# EAGLE board Opentrons_smoothieboard-5driver (EAGLE 7.2.0), part 1 of 3
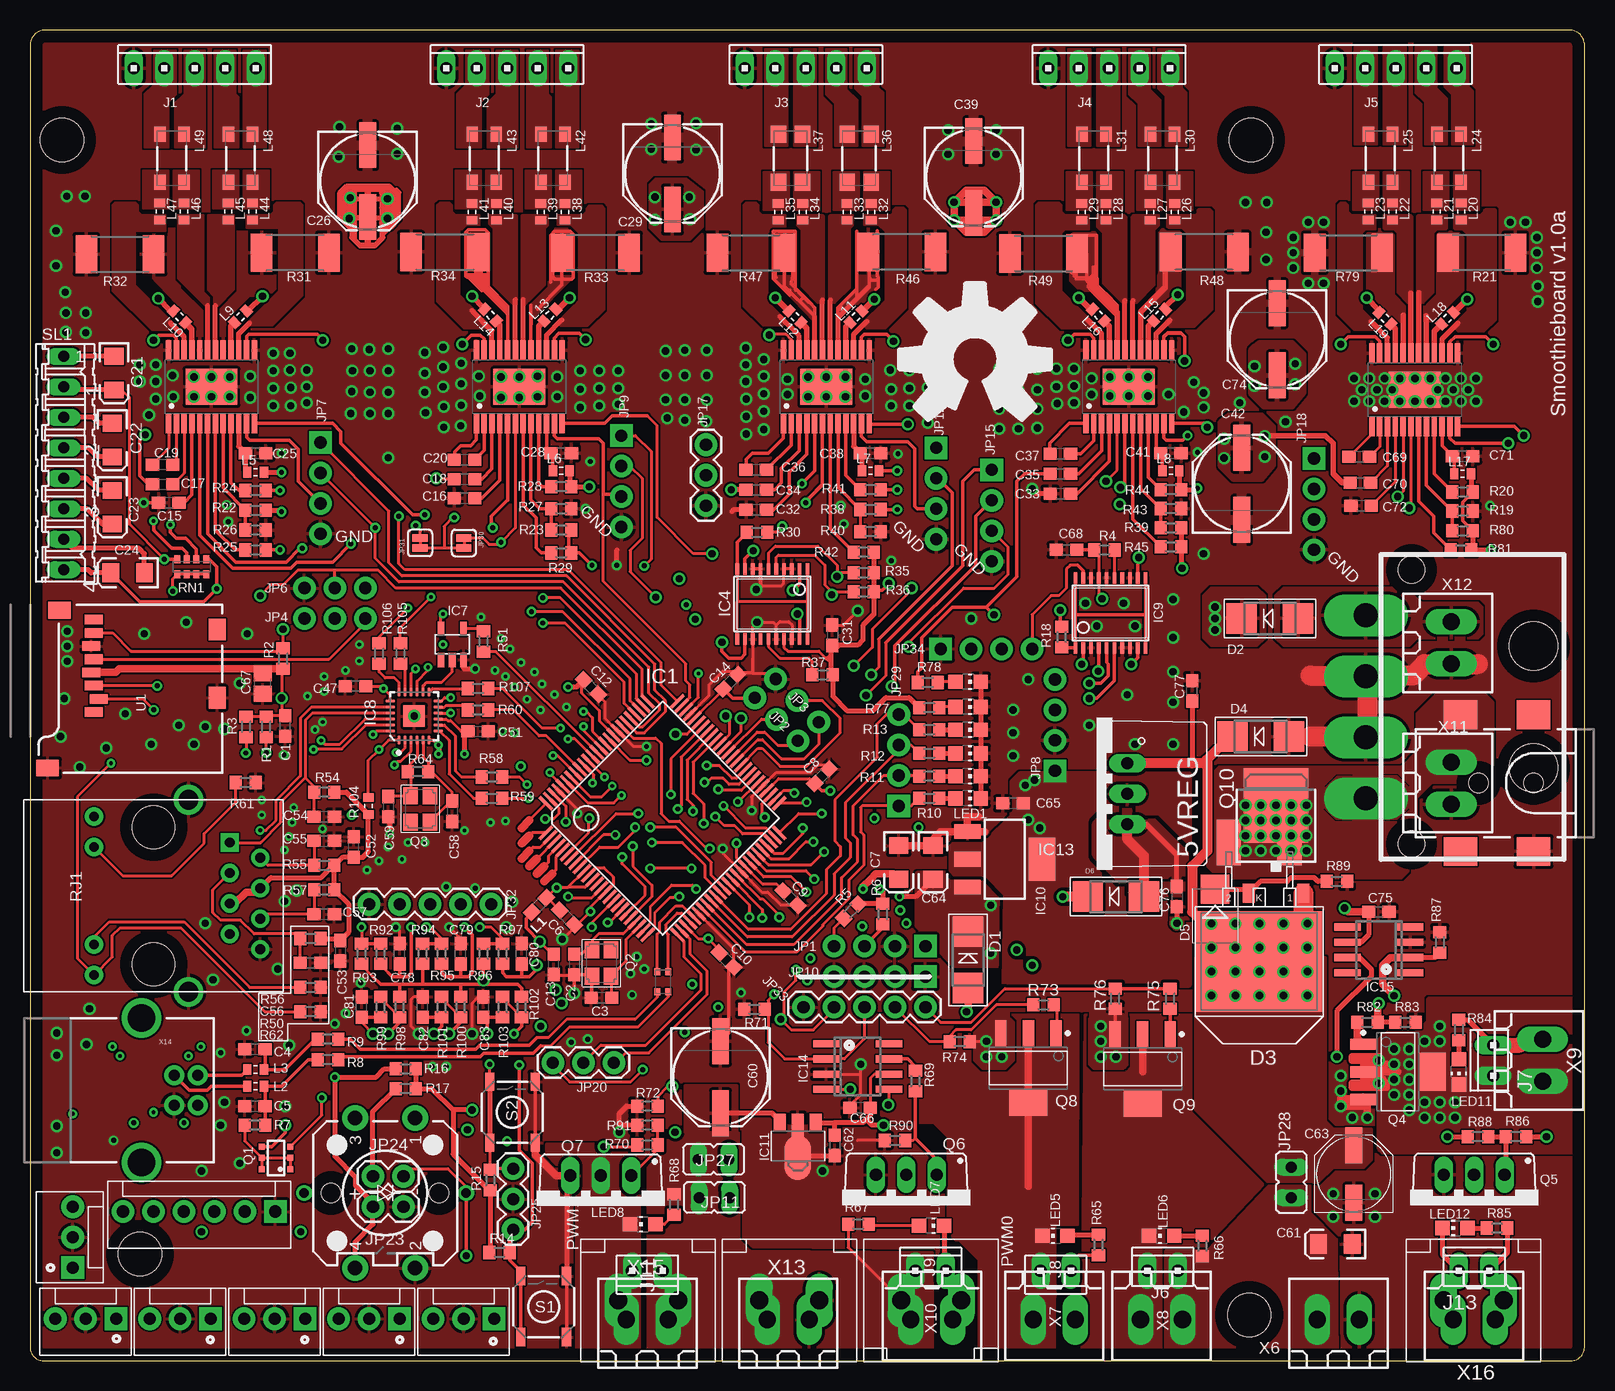
[diagram p4: board, top side]
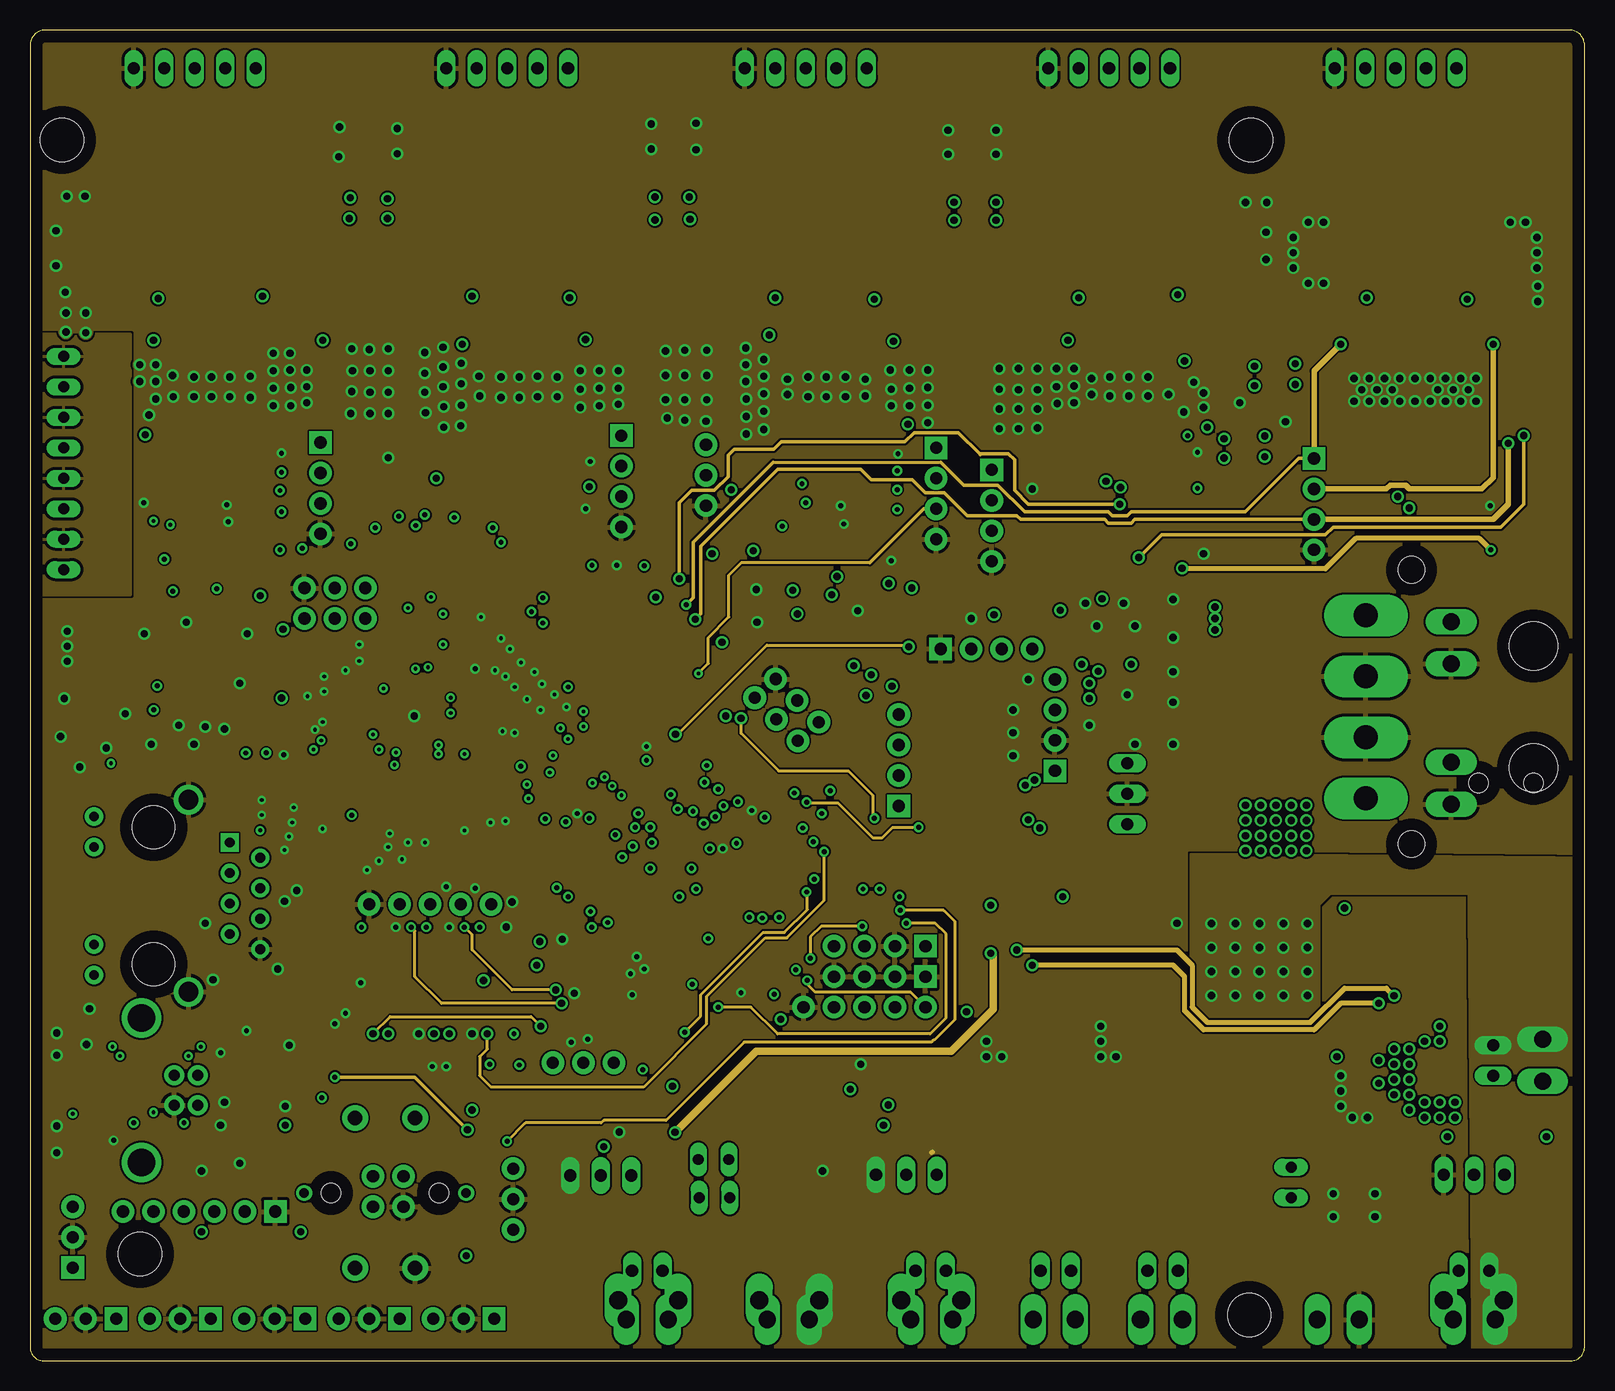
[diagram p5: board, inner layer GND]
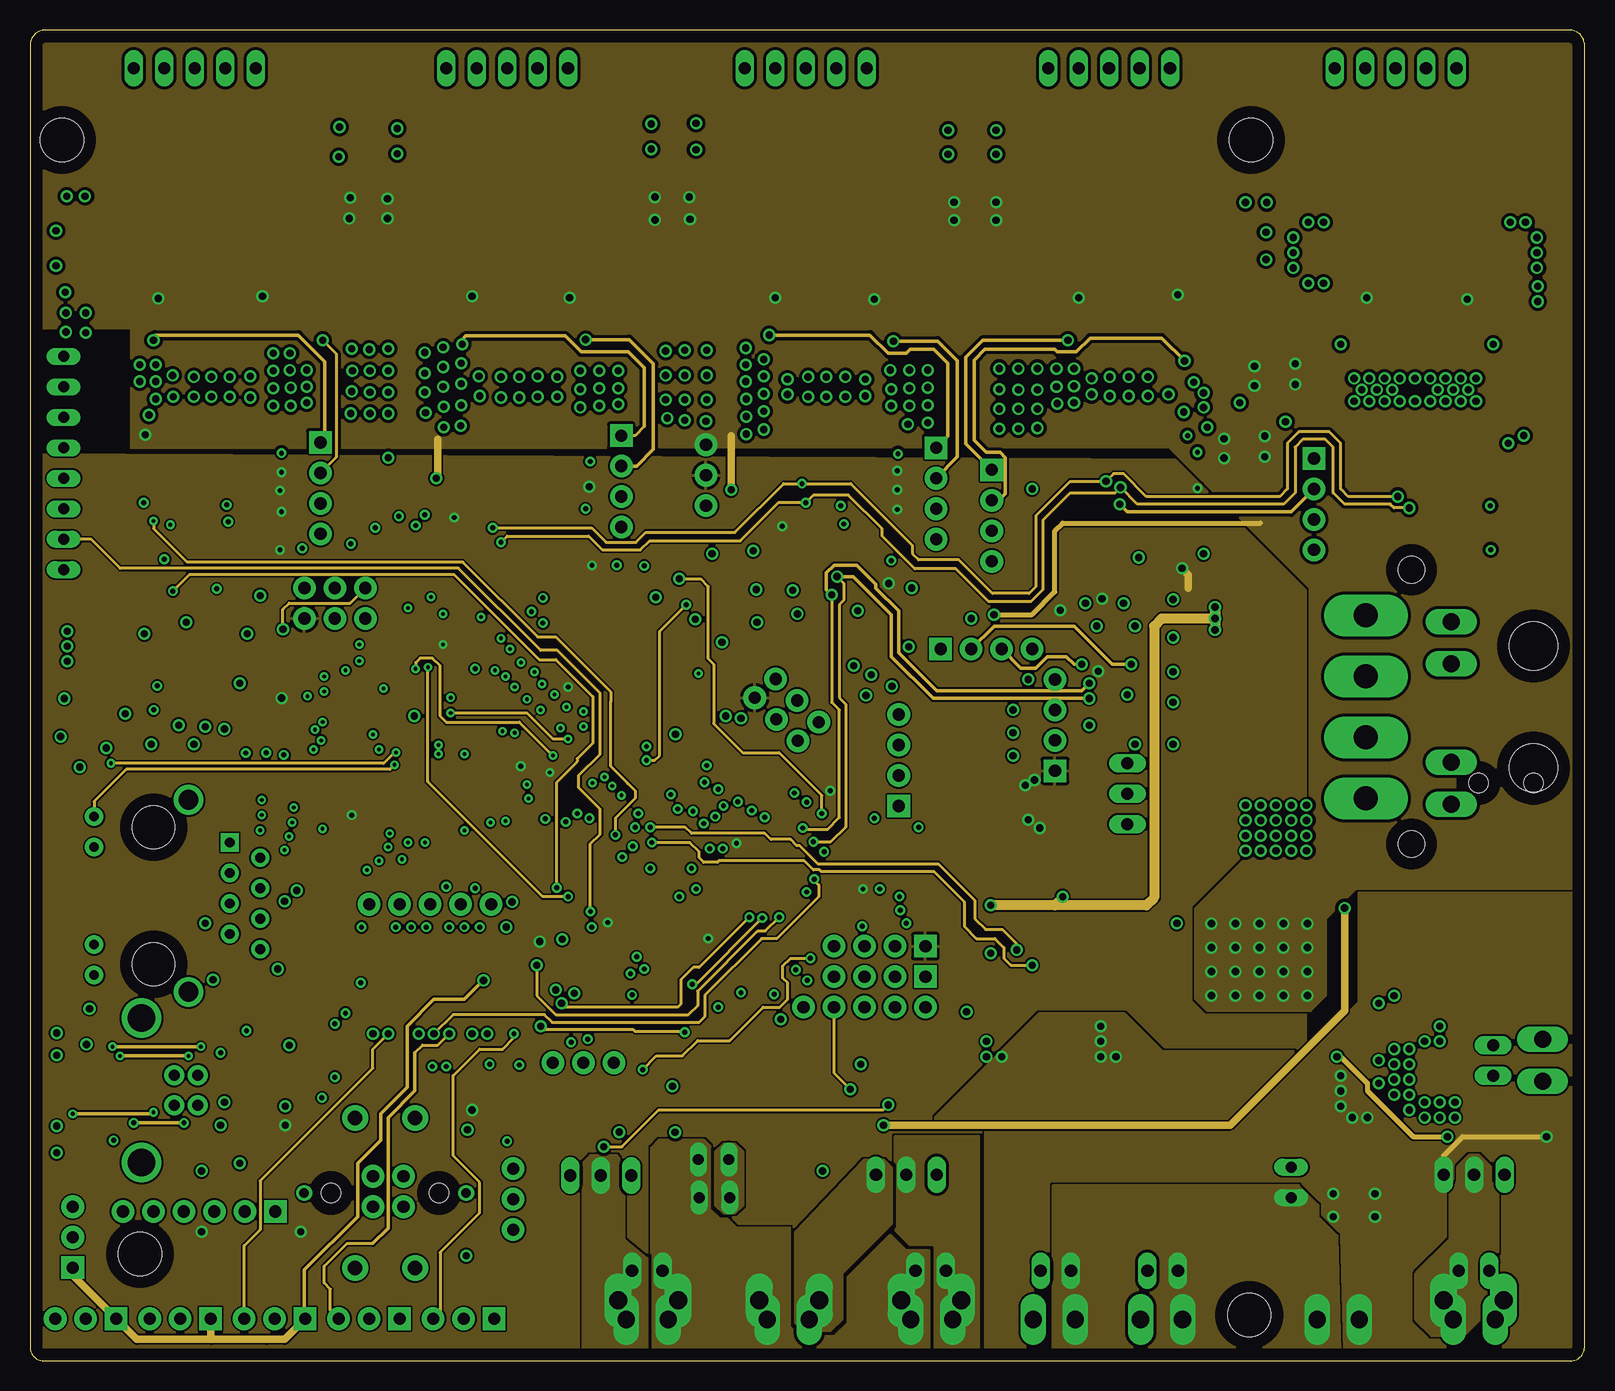
[diagram p6: board, inner layer Power]
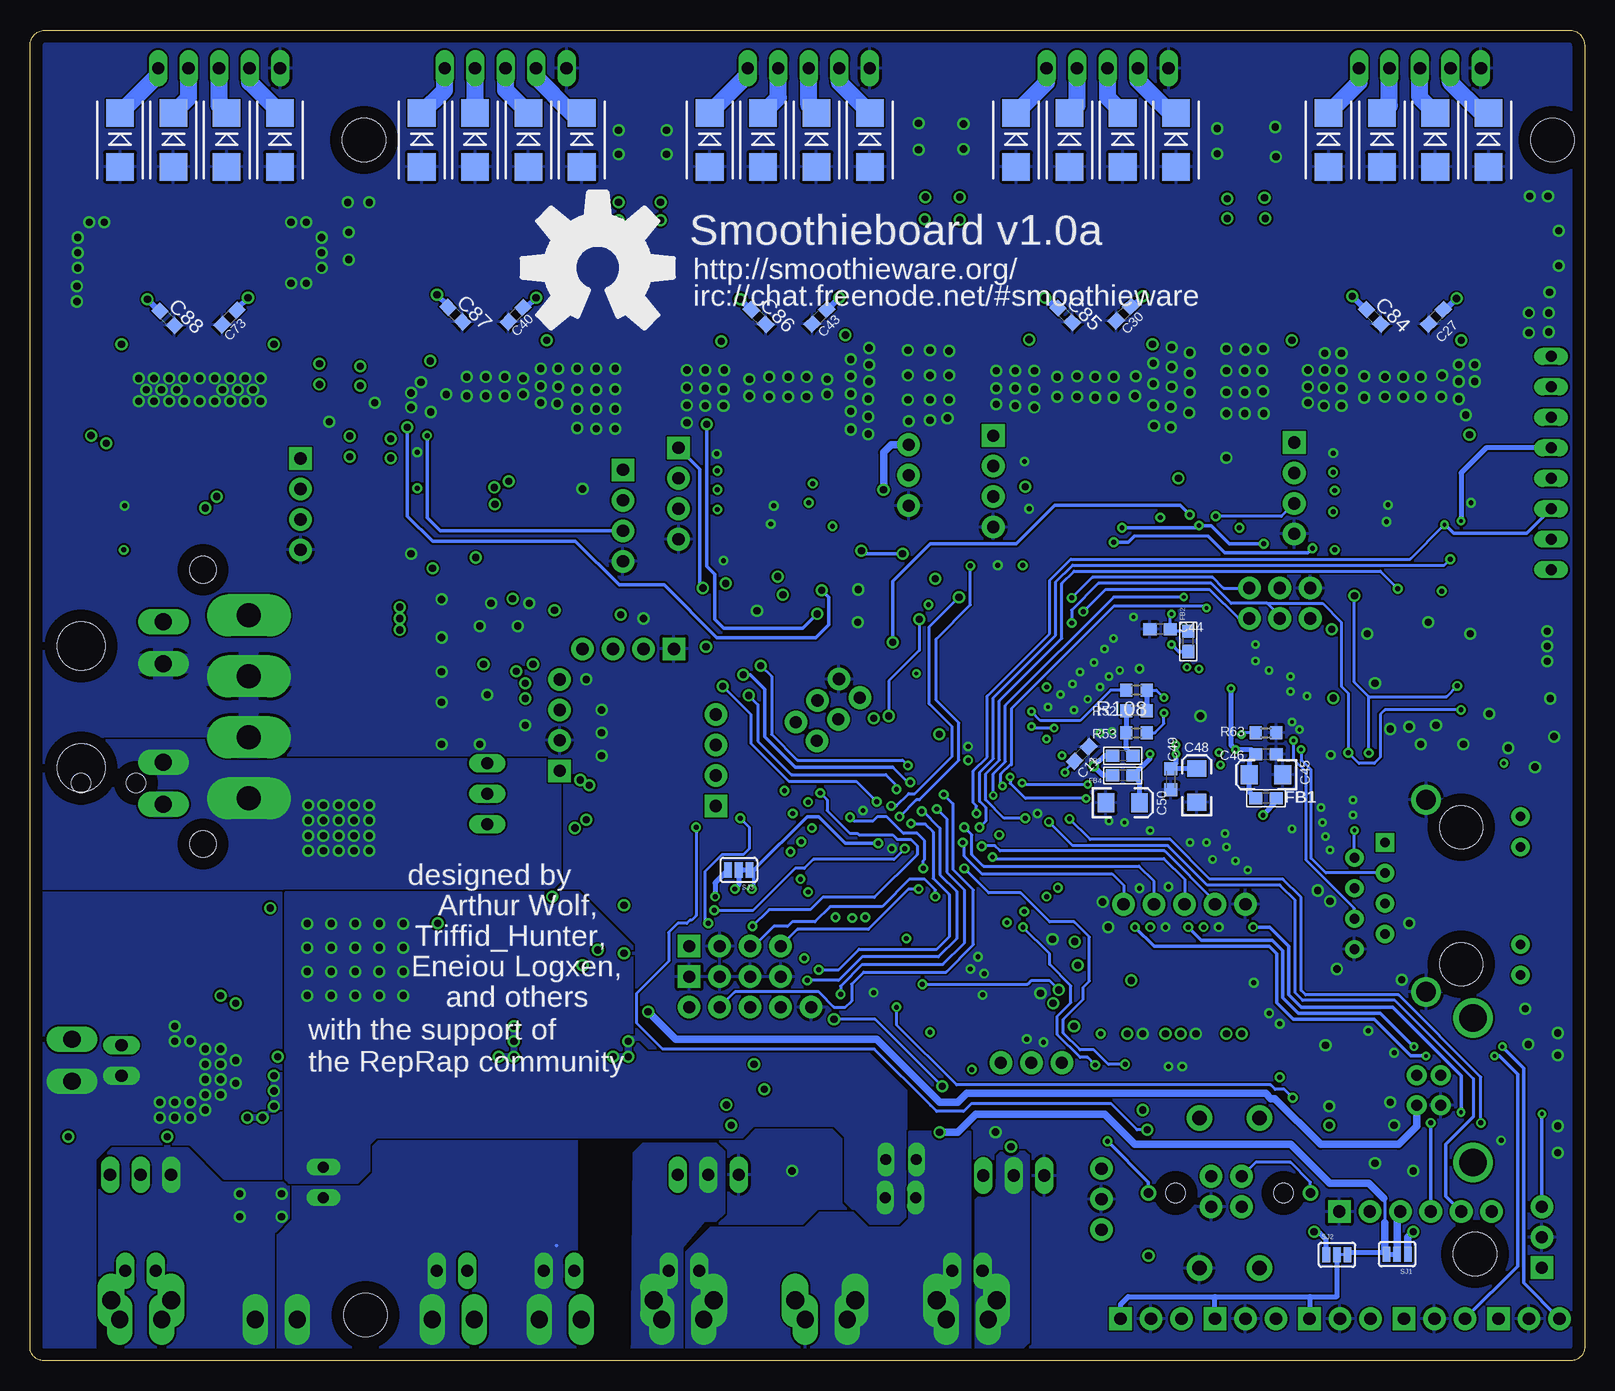
[diagram p7: board, bottom side, seen from below]

Size 129.55 x 110.89 mm. Coordinates in mm from the lower left corner, seen from the top.
Outline: 128.28,110.89 1.28,110.89 arc90 0.01,109.62 0.01,1.27 arc90 1.01,0 128.54,0 arc90 129.55,1.27 129.55,109.62 arc90 128.28,110.89
Copper layers (1*2+15*16): Top 0.035mm / dielectric 0.5mm / GND 0.035mm / dielectric 0.5mm / Power 0.035mm / dielectric 0.5mm / Bottom 0.035mm
Design rules "default *": minimum track width 10mil, minimum drill 0.3mm, track to track 6mil, track to pad 6mil, pad to pad 6mil, via to via 6mil, smd to smd 6mil, copper to edge 40mil, drill to drill 8mil, minimum pad ring 10mil, minimum via ring 8mil, stop-mask expansion 0mil, vias tented up to drill 0.61mm, thermal gap 10mil
Holes 3.6 mm at 101.73,101.73 2.67,101.73 9.15,8.89 101.61,3.81
tRestrict: 8 lines

## Footprints (pad centres in the part's own frame; a part is rotated, then mirrored left to right if it is on the bottom)
C0603 = smd 1.1 x 1: 1 -0.85,0; 2 0.85,0
EIA3216 = smd 1.4 x 1.6: A 1.4,0; C -1.4,0
PANASONIC_E = smd 3.8 x 1.4: + 3,0; - -3,0
C0603K = smd 1.05 x 1.08: 1 -0.875,0; 2 0.875,0
PANASONIC_D = smd 3 x 1.4: + 2.4,0; - -2.4,0
C0805 = smd 1.3 x 1.5: 1 -0.85,0; 2 0.85,0
SMADIODE = smd 2.54 x 2.54: A 2.349,0; C -2.349,0
TO263AB = smd 2.032 x 3.81: 1 3.81,2.54; 2 8.89,2.54 | smd 10.668 x 8.382: K 6.35,12.446
SMB = smd 2.4 x 2.4: A 2.2,0; C -2.2,0
DO214-AA_(SMB) = smd 2.3 x 2.3: 1 -2.25,0; 2 2.25,0
0603 = smd 1.1 x 1: 1 -0.85,0; 2 0.85,0
LQFP100 = smd 0.27 x 1.5: 1 -6,-7.75; 2 -5.5,-7.75; 3 -5,-7.75; 4 -4.5,-7.75; 5 -4,-7.75; 6 -3.5,-7.75; 7 -3,-7.75; 8 -2.5,-7.75; 9 -2,-7.75; 10 -1.5,-7.75; 11 -1,-7.75; 12 -0.5,-7.75; 13 0,-7.75; 14 0.5,-7.75; 15 1,-7.75; 16 1.5,-7.75; 17 2,-7.75; 18 2.5,-7.75; 19 3,-7.75; 20 3.5,-7.75; 21 4,-7.75; 22 4.5,-7.75; 23 5,-7.75; 24 5.5,-7.75; 25 6,-7.75; 51 6,7.75; 52 5.5,7.75; 53 5,7.75; 54 4.5,7.75; 55 4,7.75; 56 3.5,7.75; 57 3,7.75; 58 2.5,7.75; 59 2,7.75; 60 1.5,7.75; 61 1,7.75; 62 0.5,7.75; 63 0,7.75; 64 -0.5,7.75; 65 -1,7.75; 66 -1.5,7.75; 67 -2,7.75; 68 -2.5,7.75; 69 -3,7.75; 70 -3.5,7.75; 71 -4,7.75; 72 -4.5,7.75; 73 -5,7.75; 74 -5.5,7.75; 75 -6,7.75 | smd 1.5 x 0.27: 26 7.75,-6; 27 7.75,-5.5; 28 7.75,-5; 29 7.75,-4.5; 30 7.75,-4; 31 7.75,-3.5; 32 7.75,-3; 33 7.75,-2.5; 34 7.75,-2; 35 7.75,-1.5; 36 7.75,-1; 37 7.75,-0.5; 38 7.75,0; 39 7.75,0.5; 40 7.75,1; 41 7.75,1.5; 42 7.75,2; 43 7.75,2.5; 44 7.75,3; 45 7.75,3.5; 46 7.75,4; 47 7.75,4.5; 48 7.75,5; 49 7.75,5.5; 50 7.75,6; 76 -7.75,6; 77 -7.75,5.5; 78 -7.75,5; 79 -7.75,4.5; 80 -7.75,4; 81 -7.75,3.5; 82 -7.75,3; 83 -7.75,2.5; 84 -7.75,2; 85 -7.75,1.5; 86 -7.75,1; 87 -7.75,0.5; 88 -7.75,0; 89 -7.75,-0.5; 90 -7.75,-1; 91 -7.75,-1.5; 92 -7.75,-2; 93 -7.75,-2.5; 94 -7.75,-3; 95 -7.75,-3.5; 96 -7.75,-4; 97 -7.75,-4.5; 98 -7.75,-5; 99 -7.75,-5.5; 100 -7.75,-6
ETSSOP24 = smd 4.32 x 3: EPAD 0,0 | smd 0.45 x 1.65: P01 -3.575,-3.05; P02 -2.925,-3.05; P03 -2.275,-3.05; P04 -1.625,-3.05; P05 -0.975,-3.05; P06 -0.325,-3.05; P07 0.325,-3.05; P08 0.975,-3.05; P09 1.625,-3.05; P10 2.275,-3.05; P11 2.925,-3.05; P12 3.575,-3.05; P13 3.575,3.05; P14 2.925,3.05; P15 2.275,3.05; P16 1.625,3.05; P17 0.975,3.05; P18 0.325,3.05; P19 -0.325,3.05; P20 -0.975,3.05; P21 -1.625,3.05; P22 -2.275,3.05; P23 -2.925,3.05; P24 -3.575,3.05
TSSOP20 = smd 0.305 x 0.991: 1 -2.925,-2.918; 2 -2.275,-2.918; 3 -1.625,-2.918; 4 -0.975,-2.918; 5 -0.325,-2.918; 6 0.325,-2.918; 7 0.975,-2.918; 8 1.625,-2.918; 9 2.275,-2.918; 10 2.925,-2.918; 11 2.925,2.918; 12 2.275,2.918; 13 1.625,2.918; 14 0.975,2.918; 15 0.325,2.918; 16 -0.325,2.918; 17 -0.975,2.918; 18 -1.625,2.918; 19 -2.275,2.918; 20 -2.925,2.918
SOT23-5 = smd 0.55 x 1.2: 1 -0.95,-1.3; 2 0,-1.3; 3 0.95,-1.3; 4 0.95,1.3; 5 -0.95,1.3
QFN24_4MM = smd 0.8 x 0.28: 1 -2,1.25; 2 -2,0.75; 3 -2,0.25; 4 -2,-0.25; 5 -2,-0.75; 6 -2,-1.25; 13 2,-1.25; 14 2,-0.75; 15 2,-0.25; 16 2,0.25; 17 2,0.75; 18 2,1.25 | smd 0.28 x 0.8: 7 -1.25,-2; 8 -0.75,-2; 9 -0.25,-2; 10 0.25,-2; 11 0.75,-2; 12 1.25,-2; 19 1.25,2; 20 0.75,2; 21 0.25,2; 22 -0.25,2; 23 -0.75,2; 24 -1.25,2 | smd 1.778 x 1.778: THERM 0,0
SOT223 = smd 1.219 x 2.235: 1 -2.311,-3.099; 2 0,-3.099; 3 2.311,-3.099 | smd 3.6 x 2.2: 4 0,3.099
SOT89 = smd 1 x 1.5: 1 -1.499,-1.981; 3 1.499,-1.981 | smd 1 x 2: 2 0,-1.727 | smd 2.2 x 3.7: 2@1 0,0.94
R-78 = drill 1.016 long: 1 -2.54,2.54; 2 0,2.54; 3 2.54,2.54
SOIC8 = smd 0.6 x 2.2: 1 -1.905,-2.6; 2 -0.635,-2.6; 3 0.635,-2.6; 4 1.905,-2.6; 5 1.905,2.6; 6 0.635,2.6; 7 -0.635,2.6; 8 -1.905,2.6
10X05MTA = drill 1.016 long: 1 5.08,0; 2 2.54,0; 3 0,0; 4 -2.54,0; 5 -5.08,0
10X02MTA = drill 1.016 long: 1 1.27,0; 2 -1.27,0
POWER_JACK_SMD = smd 2.8 x 2.4: GND 0,-5.7; P$4 6.1,-5.7; VIN0 0,5.7; VIN1 6.1,5.7 | hole 1.6: 0,0; 4.572,0
1X04_NO_SILK = drill 1.016 pad 1.88 square: 1 0,0 | drill 1.016 pad 1.88: 2 2.54,0; 3 5.08,0; 4 7.62,0
1X03_NO_SILK = drill 1.016 pad 1.88: 1 0,0; 2 2.54,0; 3 5.08,0
MOLEX-1X6 = drill 1.016 pad 1.88 square: 1 0,0 | drill 1.016 pad 1.88: 2 2.54,0; 3 5.08,0; 4 7.62,0; 5 10.16,0; 6 12.7,0
JP1 = drill 0.914 long: 1 0,-1.27; 2 0,1.27
MOLEX-1X3 = drill 1.016 pad 1.88 square: 1 0,0 | drill 1.016 pad 1.88: 2 2.54,0; 3 5.08,0
1X03 = drill 1.016 pad 1.88: 1 0,0; 2 2.54,0; 3 5.08,0
1X02 = drill 1.016 pad 1.88: 1 0,0; 2 2.54,0
SJ_2S = smd 0.635 x 1.27: 1 -0.412,0; 2 0.412,0
1X05 = drill 1.016 pad 1.88: 1 0,0; 2 2.54,0; 3 5.08,0; 4 7.62,0; 5 10.16,0
0603(1608) = smd 0.7 x 0.9: 1 -0.7,0; 2 0.7,0
L-2012 = smd 0.6 x 0.5: 1 -0.83,-0.47; 2 0.83,-0.47; 3 0.83,0.47; 4 -0.83,0.47
L-4525 = smd 1.25 x 0.95: 1 -2,-1; 2 2,-1; 3 2,1; 4 -2,1
L-4528 = smd 1.4 x 1.27: 1 -2,-1; 2 2,-1; 3 2,1; 4 -2,1
CHIP-LED0805 = smd 1.2 x 1.2: A 0,-1.05; C 0,1.05
MOLEX8981 = drill 2 pad 3.5 long: P$1 -1.27,2.54; P$2 -1.27,7.62; P$3 -1.27,12.7; P$4 -1.27,17.78 | hole 2.2: 2.54,21.59; 2.54,-1.27 | hole 4: 12.7,5.08; 12.7,15.24
SC74_INFINEON = smd 0.5 x 0.5: 1 -0.95,-1.2; 2 0,-1.2; 3 0.95,-1.2; 4 0.95,1.2; 5 0,1.2; 6 -0.95,1.2
CRYSTAL_3.2X2.5 = smd 1.4 x 1.2: 1 -1.1,-0.8; 2 1.1,0.8; GND1 -1.1,0.8; GND2 1.1,-0.8
SOT230P700X160-4N = smd 2.15 x 0.95: 1 -2.9,2.3; 2 -2.9,0; 3 -2.9,-2.3 | smd 2.15 x 3.15: 4 2.9,0
TO220BV = drill 1.016 long: D 0,-2.54; G -2.54,-2.54; S 2.54,-2.54
TO252 = smd 1 x 1.6: 1 -2.28,-4.8; 2 2.28,-4.8 | smd 5.4 x 6.2: 3 0,2.5
R0603 = smd 1 x 1.1: 1 -0.85,0; 2 0.85,0
R2512 = smd 1.8 x 3.2: 1 -2.8,0; 2 2.8,0
HR911105A = drill 0.813 pad 1.524: G+ 4.953,-6.604; G- 4.953,-4.064; GND -8.89,4.445; NC -6.35,3.175; P4 -8.89,-0.635; P5 -6.35,0.635; RD+ -6.35,-1.905; RD- -8.89,1.905; TD- -8.89,-3.175; Y+ 4.953,6.604; Y- 4.953,4.064 | drill 1.651 pad 2.159: SHIELD0 -2.921,8.001; SHIELD1 -2.921,-8.001 | drill 0.813 pad 1.524 square: TD+ -6.35,-4.445 | hole 3.556: 0,-5.715; 0,5.715
0603-ARV = smd 0.5 x 0.65: 1 -1.2,-0.625; 2 -0.4,-0.625; 3 0.4,-0.625; 4 1.2,-0.625; 5 1.2,0.625; 6 0.4,0.625; 7 -0.4,0.625; 8 -1.2,0.625
TACTILE_SWITCH_SMD = smd 1.524 x 0.762: 1 -2.54,1.905; 2 2.54,1.905; 3 -2.54,-1.905; 4 2.54,-1.905
TACTILE-PTH-LED-12MM = drill 1.2 pad 2.159: 1 -6.25,2.5; 2 6.25,2.5; 3 -6.25,-2.5; 4 6.25,-2.5 | drill 0.8: A 0,6.75; C 0,-6.75 | hole 1.6: 0,4.5; 0,-4.5
SJ_3 = smd 0.635 x 1.27: 1 -0.889,0; 2 0,0; 3 0.889,0
08P = drill 0.914 long: 1 -8.89,0; 2 -6.35,0; 3 -3.81,0; 4 -1.27,0; 5 1.27,0; 6 3.81,0; 7 6.35,0; 8 8.89,0
MICRO-SD-SOCKET-PP = smd 0.8 x 1.5: 1 -8.94,10.7; 2 -7.84,10.3; 3 -6.74,10.7; 4 -5.64,10.9; 5 -4.54,10.7; 6 -3.44,10.9; 7 -2.34,10.7; 8 -1.24,10.7 | smd 1.8 x 1.4: CD1 -2.05,0.4; CD2 -7.75,0.4 | smd 1.4 x 1.9: GND1 -13.6,14.55; GND3 -0.45,13.55
1715250000 = drill 1.5 long: P$1 0,0; P$2 5,0
180G-2 = drill 1.422 long: 1 -1.75,0; 2 1.75,0
USB-B-PTH = drill 0.914 pad 1.676: D+ 0,1.25; D- 1.981,1.25; GND 0,-1.25; VBUS 1.981,-1.25 | drill 2.286: S1 -2.718,-6.02; S2 -2.718,6.02

## Placement (x,y rotation side)
C1  .1uF  [C0603]  21.28,52.9 90 top
C2  12pF  [C0603]  45.35,33.02 270 top
C3  12pF  [C0603]  47.63,30.23 180 top
C4  18pF  [C0603]  18.74,25.97 0 top
C5  18pF  [C0603]  18.74,21.21 0 top
C6  .1uF  [C0603]  44.75,36.94 315 top
C7  10uF  [EIA3216]  72.4,41.53 270 top
C8  .1uF  [C0603]  65.98,48.7 225 top
C9  .1uF  [C0603]  63.38,38.54 135 top
C10  .1uF  [C0603]  58.05,33.4 135 top
C11  .1uF  [C0603]  41.92,50.55 225 bottom
C12  .1uF  [C0603]  46.74,56.13 135 top
C13  .1uF  [C0603]  43.64,33.03 90 top
C14  .1uF  [C0603]  58.36,56.58 225 top
C15  .22uF  [C0603]  11.56,71.5 0 top
C16  .22uF  [C0603]  36.2,71.88 0 top
C17  .1uF  [C0603]  11.06,73.02 0 top
C18  .1uF  [C0603]  36.2,73.47 0 top
C19  .1uF  [C0603]  11.06,74.68 180 top
C20  .1uF  [C0603]  36.2,75.06 180 top
C21  10uF  [EIA3216]  6.99,82.3 270 top
C22  10uF  [EIA3216]  6.87,76.71 270 top
C23  10uF  [EIA3216]  6.87,71.12 270 top
C24  10uF  [EIA3216]  8.14,65.66 180 top
C25  .1uF  [C0603]  18.8,75.63 0 top
C26  100uF  [PANASONIC_E]  28.14,98.3 270 top
C27  .1uF  [C0603]  12.39,86.99 225 bottom
C28  .1uF  [C0603]  44.27,75.63 0 top
C29  100uF  [PANASONIC_E]  53.54,98.93 270 top
C30  .1uF  [C0603]  38.43,87.25 225 bottom
C31  .1uF  [C0603]  66.87,60.45 270 top
C32  .22uF  [C0603]  60.52,70.93 0 top
C33  .22uF  [C0603]  85.86,72.26 0 top
C34  .1uF  [C0603]  60.52,72.58 0 top
C35  .1uF  [C0603]  85.86,73.91 0 top
C36  .1uF  [C0603]  60.52,74.23 180 top
C37  .1uF  [C0603]  85.86,75.56 180 top
C38  .1uF  [C0603]  70.05,75.63 0 top
C39  100uF  [PANASONIC_E]  78.65,98.63 270 top
C40  .1uF  [C0603]  89.08,87.17 225 bottom
C41  .1uF  [C0603]  95.07,75.63 0 top
C42  100uF  [PANASONIC_E]  100.98,73.08 90 top
C43  .1uF  [C0603]  63.76,86.99 225 bottom
C44  .1uF  [C0603]  35.38,60.96 180 bottom
C45  10uF  [EIA3216]  26.55,48.83 180 bottom
C46  .1uF  [C0603]  26.55,50.55 0 bottom
C47  .1uF  [C0603]  27.12,56.2 180 top
C48  1uF  [EIA3216]  32.33,47.94 90 bottom
C49  470pF  [C0603K]  34.49,48.45 270 bottom
C50  10uF  [EIA3216]  38.49,46.48 0 bottom
C51  .1uF  [C0603]  37.35,52.45 0 top
C52  .1uF  [C0603]  27,42.8 90 top
C53  .1uF  [C0603]  25.85,34.16 270 top
C54  18pF  [C0603]  24.52,45.34 0 top
C55  18pF  [C0603]  24.52,43.31 0 top
C56  18pF  [C0603]  23.38,33.15 0 top
C57  18pF  [C0603]  24.52,37.21 0 top
C58  12pF  [C0603]  35.19,45.78 270 top
C59  12pF  [C0603]  29.85,46.16 270 top
C60  100uF  [PANASONIC_E]  57.54,23.62 270 top
C61  10uF  [EIA3216]  108.78,9.72 180 top
C62  .1uF  [C0603]  67.06,17.94 270 top
C63  100uF  [PANASONIC_D]  110.31,15.56 90 top
C64  10uF  [EIA3216]  75.26,41.53 270 top
C65  .1uF  [C0603]  81.92,46.44 180 top
C66  .1uF  [C0603]  69.18,21.06 180 top
C67  1uF  [C0805]  19.41,56.43 90 top
C68  .1uF  [C0603]  86.37,67.56 0 top
C69  .1uF  [C0603]  110.77,75.31 180 top
C70  .1uF  [C0603]  110.86,73.15 0 top
C71  .1uF  [C0603]  119.39,75.37 0 top
C72  .22uF  [C0603]  110.93,71.25 0 top
C73  .1uF  [C0603]  112.93,86.94 225 bottom
C74  100uF  [PANASONIC_E]  103.93,85.12 270 top
C75  .1uF  [C0603]  112.4,37.4 0 top
C76  .1uF  [C0603]  95.58,38.67 270 top
C77  .33uF  [C0603]  96.85,55.82 90 top
C78  .1uF  [C0603]  30.81,33.91 90 top
C79  .1uF  [C0603]  35.89,33.91 90 top
C80  .1uF  [C0603]  40.97,33.91 90 top
C81  .1uF  [C0603]  27.63,29.46 90 top
C82  .1uF  [C0603]  32.71,29.46 90 top
C83  .1uF  [C0603]  37.79,29.46 90 top
C84  .1uF  [C0603]  17.58,86.99 315 bottom
C85  .1uF  [C0603]  43.29,87.12 315 bottom
C86  .1uF  [C0603]  68.84,86.97 315 bottom
C87  .1uF  [C0603]  94.11,87.17 315 bottom
C88  .1uF  [C0603]  118.12,86.87 315 bottom
D1  MBRA210LT3  [SMADIODE]  78.18,33.4 270 top
D2  MBRA210LT3  [SMADIODE]  103.32,61.85 0 top
D3  VS-25CTQ045S  [TO263AB]  108.78,45.72 180 top
D4  B1100-13-F  [SMADIODE]  102.56,52.01 0 top
D5  15v  [SMB]  98.75,37.08 270 top
D6  MBRA210LT3  [SMADIODE]  90.5,38.67 0 top
D7  SMBJ16(C)A  [DO214-AA_(SMB)]  21.34,101.73 90 bottom
D8  SMBJ16(C)A  [DO214-AA_(SMB)]  16.9,101.73 90 bottom
D9  SMBJ16(C)A  [DO214-AA_(SMB)]  12.45,101.73 90 bottom
D10  SMBJ16(C)A  [DO214-AA_(SMB)]  8.01,101.73 90 bottom
D11  SMBJ16(C)A  [DO214-AA_(SMB)]  47.38,101.73 90 bottom
D12  SMBJ16(C)A  [DO214-AA_(SMB)]  42.93,101.73 90 bottom
D13  SMBJ16(C)A  [DO214-AA_(SMB)]  38.49,101.73 90 bottom
D14  SMBJ16(C)A  [DO214-AA_(SMB)]  34.04,101.73 90 bottom
D15  SMBJ16(C)A  [DO214-AA_(SMB)]  72.91,101.73 90 bottom
D16  SMBJ16(C)A  [DO214-AA_(SMB)]  68.46,101.73 90 bottom
D17  SMBJ16(C)A  [DO214-AA_(SMB)]  64.02,101.73 90 bottom
D18  SMBJ16(C)A  [DO214-AA_(SMB)]  59.57,101.73 90 bottom
D19  SMBJ16(C)A  [DO214-AA_(SMB)]  96.91,101.73 90 bottom
D20  SMBJ16(C)A  [DO214-AA_(SMB)]  92.46,101.73 90 bottom
D21  SMBJ16(C)A  [DO214-AA_(SMB)]  88.02,101.73 90 bottom
D22  SMBJ16(C)A  [DO214-AA_(SMB)]  83.57,101.73 90 bottom
D23  SMBJ16(C)A  [DO214-AA_(SMB)]  122.05,101.73 90 bottom
D24  SMBJ16(C)A  [DO214-AA_(SMB)]  117.61,101.73 90 bottom
D25  SMBJ16(C)A  [DO214-AA_(SMB)]  113.16,101.73 90 bottom
D26  SMBJ16(C)A  [DO214-AA_(SMB)]  108.72,101.73 90 bottom
FB1  [0603]  26.55,46.86 180 bottom
FB2  BEAD0603S601A20T  [0603]  33.03,59.94 90 bottom
FB3  BEAD0603S601A20T  [0603]  38.49,50.42 180 bottom
FB4  BEAD0603S601A20T  [0603]  38.49,48.77 180 bottom
IC1  LPC1769  [LQFP100]  52.71,45.21 315 top
IC2  A4982  [ETSSOP24]  15.12,81.15 0 top
IC3  A4982  [ETSSOP24]  40.77,81.15 0 top
IC4  MCP44X1  [TSSOP20]  61.86,63.06 180 top
IC5  A4982  [ETSSOP24]  66.37,81.15 0 top
IC6  A4982  [ETSSOP24]  91.57,81.15 0 top
IC7  [SOT23-5]  35.19,59.69 0 top
IC8  [QFN24_4MM]  32.01,53.72 90 top
IC9  MCP44X1  [TSSOP20]  90.04,62.31 0 top
IC10  LM1117-3.3V  [SOT223]  81.22,41.78 270 top
IC11  78L12F  [SOT89]  63.99,17.86 180 top
IC12  A4982  [ETSSOP24]  115.4,80.91 0 top
IC13  R-78E-5.0  [R-78]  88.91,47.24 270 top
IC14  TC4427  [SOIC8]  68.97,24.51 270 top
IC15  TC4427  [SOIC8]  112.4,34.23 90 top
J1  [10X05MTA]  13.72,107.7 0 top
J2  [10X05MTA]  39.76,107.7 0 top
J3  [10X05MTA]  64.65,107.7 0 top
J4  [10X05MTA]  89.92,107.7 0 top
J5  [10X05MTA]  113.8,107.7 0 top
J6  [10X02MTA]  94.39,7.49 0 top
J7  [10X02MTA]  121.93,25.02 90 top
J8  [10X02MTA]  85.48,7.49 180 top
J9  [10X02MTA]  75.06,7.49 0 top
J10  POWER_JACKSMD  [POWER_JACK_SMD]  125.29,48.13 180 top
J11  [10X02MTA]  51.44,7.49 180 top
J13  [10X02MTA]  120.34,7.49 0 top
JP1  [1X04_NO_SILK]  74.62,34.54 180 top
JP2  [1X03_NO_SILK]  60.4,55.25 315 top
JP3  [1X03_NO_SILK]  65.73,53.21 135 top
JP4  [1X03_NO_SILK]  22.87,61.85 0 top
JP5  [MOLEX-1X6]  20.44,12.43 180 top
JP6  [1X03_NO_SILK]  27.95,64.39 180 top
JP7  [1X04_NO_SILK]  24.2,76.52 270 top
JP8  [1X04_NO_SILK]  85.42,49.15 90 top
JP9  [1X04_NO_SILK]  49.28,77.09 270 top
JP10  [1X04_NO_SILK]  74.62,32 180 top
JP11  [JP1]  57.03,13.59 270 top
JP12  [1X04_NO_SILK]  75.51,76.07 270 top
JP14  [MOLEX-1X3]  7.18,3.49 180 top
JP15  [1X04_NO_SILK]  80.14,74.23 270 top
JP16  [MOLEX-1X3]  15.06,3.49 180 top
JP17  [1X03]  56.33,76.33 270 top
JP18  [1X04_NO_SILK]  107.01,75.18 270 top
JP19  [MOLEX-1X3]  22.93,3.49 180 top
JP20  [1X03]  48.65,24.83 180 top
JP21  [MOLEX-1X3]  30.81,3.49 180 top
JP22  [MOLEX-1X3]  38.68,3.49 180 top
JP23  [1X02]  28.58,12.83 0 top
JP24  [1X02]  28.58,15.37 0 top
JP25  [1X03]  40.27,10.92 90 top
JP26  [MOLEX-1X3]  3.56,7.75 90 top
JP27  [JP1]  56.97,16.76 270 top
JP28  [JP1]  105.1,14.86 0 top
JP29  [1X04_NO_SILK]  72.4,46.23 90 top
JP30  [SJ_2S]  36.15,68.15 270 top
JP31  [SJ_2S]  32.51,68.14 90 top
JP32  [1X05]  38.43,38.04 180 top
JP33  [1X05]  74.62,29.46 180 top
JP34  [1X04_NO_SILK]  75.89,59.31 0 top
L1  [0603]  42.43,37.97 225 top
L2  BEAD0603S221T  [0603(1608)]  18.8,22.86 0 top
L3  BEAD0603S221T  [0603(1608)]  18.8,24.26 0 top
L4  CHOK2012S221T  [L-2012]  52.74,31.57 270 top
L5  BEAD0603S601A20T  [0603(1608)]  18.8,74.04 0 top
L6  BEAD0603S601A20T  [0603(1608)]  44.27,74.17 0 top
L7  BEAD0603S601A20T  [0603(1608)]  70.05,74.17 0 top
L8  BEAD0603S601A20T  [0603(1608)]  95.07,74.17 0 top
L9  BEAD0603S601A20T  [0603(1608)]  17.53,86.99 45 top
L10  BEAD0603S601A20T  [0603(1608)]  12.45,86.99 135 top
L11  BEAD0603S601A20T  [0603(1608)]  68.84,86.99 45 top
L12  BEAD0603S601A20T  [0603(1608)]  63.76,86.99 135 top
L13  BEAD0603S601A20T  [0603(1608)]  43.31,87.12 45 top
L14  BEAD0603S601A20T  [0603(1608)]  38.36,87.12 135 top
L15  BEAD0603S601A20T  [0603(1608)]  94.11,87.12 45 top
L16  BEAD0603S601A20T  [0603(1608)]  89.03,87.12 135 top
L17  BEAD0603S601A20T  [0603(1608)]  119.39,73.91 0 top
L18  BEAD0603S601A20T  [0603(1608)]  118.12,86.87 45 top
L19  BEAD0603S601A20T  [0603(1608)]  112.91,86.87 135 top
L20  BEAD0603S601A20T  [0603(1608)]  119.26,95.76 270 top
L21  BEAD0603S601A20T  [0603(1608)]  117.23,95.76 270 top
L22  BEAD0603S601A20T  [0603(1608)]  113.55,95.76 270 top
L23  BEAD0603S601A20T  [0603(1608)]  111.51,95.76 270 top
L24  CHOK4525S601A15T  [L-4525]  118.24,100.2 270 top
L25  CHOK4525S601A15T  [L-4525]  112.53,100.2 270 top
L26  BEAD0603S601A20T  [0603(1608)]  95.38,95.73 270 top
L27  BEAD0603S601A20T  [0603(1608)]  93.35,95.73 270 top
L28  BEAD0603S601A20T  [0603(1608)]  89.67,95.73 270 top
L29  BEAD0603S601A20T  [0603(1608)]  87.64,95.73 270 top
L30  CHOK4525S601A15T  [L-4525]  94.37,100.2 270 top
L31  CHOK4525S601A15T  [L-4525]  88.65,100.2 270 top
L32  BEAD0603S601A20T  [0603(1608)]  70.11,95.73 270 top
L33  BEAD0603S601A20T  [0603(1608)]  68.08,95.73 270 top
L34  BEAD0603S601A20T  [0603(1608)]  64.4,95.73 270 top
L35  BEAD0603S601A20T  [0603(1608)]  62.36,95.73 270 top
L36  CHOK4528S601A25T  [L-4528]  69.1,100.2 270 top
L37  CHOK4528S601A25T  [L-4528]  63.38,100.2 270 top
L38  BEAD0603S601A20T  [0603(1608)]  44.58,95.73 270 top
L39  BEAD0603S601A20T  [0603(1608)]  42.55,95.73 270 top
L40  BEAD0603S601A20T  [0603(1608)]  38.87,95.73 270 top
L41  BEAD0603S601A20T  [0603(1608)]  36.84,95.73 270 top
L42  CHOK4525S601A15T  [L-4525]  43.57,100.2 270 top
L43  CHOK4525S601A15T  [L-4525]  37.85,100.2 270 top
L44  BEAD0603S601A20T  [0603(1608)]  18.55,95.76 270 top
L45  BEAD0603S601A20T  [0603(1608)]  16.52,95.76 270 top
L46  BEAD0603S601A20T  [0603(1608)]  12.83,95.76 270 top
L47  BEAD0603S601A20T  [0603(1608)]  10.8,95.76 270 top
L48  CHOK4525S601A15T  [L-4525]  17.53,100.2 270 top
L49  CHOK4525S601A15T  [L-4525]  11.82,100.2 270 top
LED1  [CHIP-LED0805]  78.18,46.86 270 top
LED2  [CHIP-LED0805]  78.18,48.7 270 top
LED3  [CHIP-LED0805]  78.18,50.61 270 top
LED4  [CHIP-LED0805]  78.18,52.58 270 top
LED5  [CHIP-LED0805]  85.42,10.41 90 top
LED6  [CHIP-LED0805]  94.31,10.41 90 top
LED7  [CHIP-LED0805]  75.13,11.24 270 top
LED8  [CHIP-LED0805]  51.06,11.37 90 top
LED9  [CHIP-LED0805]  78.18,54.48 270 top
LED10  [CHIP-LED0805]  78.18,56.58 270 top
LED11  [CHIP-LED0805]  119.07,24.07 180 top
LED12  [CHIP-LED0805]  118.75,11.05 90 top
POWER  POWER  [MOLEX8981]  112.59,44.32 0 top
Q1  BSL207SP  [SC74_INFINEON]  20.51,16.89 90 top
Q2  12MHz  [CRYSTAL_3.2X2.5]  47.63,33.15 90 top
Q3  25MHz  [CRYSTAL_3.2X2.5]  32.52,45.97 270 top
Q4  ZXMN4A06  [SOT230P700X160-4N]  113.99,24.07 0 top
Q5  AOT240L  [TO220BV]  120.34,12.95 180 top
Q6  AOT240L  [TO220BV]  73.03,12.95 180 top
Q7  AOT240L  [TO220BV]  47.57,12.89 180 top
Q8  ZXMN4A06  [SOT230P700X160-4N]  83.19,24.38 270 top
Q9  ZXMN4A06  [SOT230P700X160-4N]  92.72,24.32 270 top
Q10  SUD50P04-08-GE3  [TO252]  103.83,43.75 0 top
R1  10K  [R0603]  19.68,52.81 90 top
R2  10K  [R0603]  21.08,58.5 270 top
R3  10K  [R0603]  18,52.81 90 top
R4  100K  [R0603]  89.54,67.56 180 top
R5  2.2k  [R0603]  68.4,37.46 45 top
R6  2.2k  [R0603]  71.06,37.21 90 top
R7  1.5K  [R0603]  18.74,19.62 180 top
R8  33R  [R0603]  24.84,25.08 0 top
R9  33R  [R0603]  24.84,26.8 0 top
R10  1k  [R0603]  74.94,46.86 180 top
R11  1k  [R0603]  74.94,48.7 180 top
R12  1k  [R0603]  74.94,50.61 180 top
R13  1k  [R0603]  74.94,52.58 180 top
R14  10K  [R0603]  39.12,9.02 180 top
R15  10K  [R0603]  38.36,15.05 270 top
R16  10K  [R0603]  31.31,24.32 0 top
R17  330R  [R0603]  31.31,22.67 180 top
R18  33K  [R0603]  85.98,60.3 90 top
R19  10K  [R0603]  119.39,70.8 0 top
R20  10K  [R0603]  119.39,72.39 0 top
R21  0.05R  [R2512]  120.98,92.33 180 top
R22  NP  [R0603]  18.8,70.87 180 top
R23  NP  [R0603]  44.27,69.21 0 top
R24  10K  [R0603]  18.8,72.52 0 top
R25  10K  [R0603]  18.8,67.56 0 top
R26  10K  [R0603]  18.8,69.21 0 top
R27  10K  [R0603]  44.27,70.99 0 top
R28  10K  [R0603]  44.27,72.83 0 top
R29  10K  [R0603]  44.27,67.31 0 top
R30  33K  [R0603]  60.59,69.02 0 top
R31  0.05R  [R2512]  22.11,92.33 180 top
R32  0.05R  [R2512]  7.5,92.2 0 top
R33  0.05R  [R2512]  47.12,92.33 180 top
R34  0.05R  [R2512]  34.55,92.39 0 top
R35  2.2k  [R0603]  69.48,65.66 0 top
R36  2.2k  [R0603]  69.48,64.07 0 top
R37  100K  [R0603]  66.05,57.15 0 top
R38  NP  [R0603]  70.05,70.93 0 top
R39  NP  [R0603]  95.07,69.41 0 top
R40  10K  [R0603]  70.05,69.09 0 top
R41  10K  [R0603]  70.05,72.58 0 top
R42  10K  [R0603]  69.48,67.37 0 top
R43  10K  [R0603]  95.07,71.01 0 top
R44  10K  [R0603]  95.07,72.58 0 top
R45  10K  [R0603]  95.07,67.82 0 top
R46  0.05R  [R2512]  72.65,92.39 180 top
R47  0.05R  [R2512]  60.08,92.33 0 top
R48  0.05R  [R2512]  97.86,92.39 180 top
R49  0.05R  [R2512]  84.46,92.27 0 top
R50  330R  [R0603]  23.38,31.11 180 top
R51  22R  [R0603]  37.79,59.94 270 top
R52  1.5K  [R0603]  37.35,54.17 180 bottom
R53  10K  [R0603]  37.35,52.32 180 bottom
R54  49.9R  [R0603]  24.52,47.37 180 top
R55  49.9R  [R0603]  24.52,41.28 180 top
R56  49.9R  [R0603]  23.38,35.18 180 top
R57  49.9R  [R0603]  24.52,39.24 180 top
R58  22R  [R0603]  38.49,48.64 0 top
R59  22R  [R0603]  38.49,46.86 0 top
R60  22R  [R0603]  37.35,54.23 0 top
R61  330R  [R0603]  17.98,48.18 180 top
R62  10K  [R0603]  23.38,29.08 180 top
R63  12.1K  [R0603]  26.55,52.32 180 bottom
R64  1M  [R0603]  32.33,49.09 180 top
R65  5.6K  [R0603]  89.03,9.65 90 top
R66  5.6K  [R0603]  97.69,9.56 90 top
R67  5.6K  [R0603]  69.03,11.37 0 top
R68  5.6K  [R0603]  53.67,13.02 270 top
R69  22R  [R0603]  73.78,23.29 270 top
R70  22R  [R0603]  51.44,17.97 0 top
R71  10k  [R0603]  60.36,29.28 0 top
R72  10k  [R0603]  51.44,21.21 0 top
R73  22R  [R0603]  84.46,29.65 180 top
R74  10k  [R0603]  77.48,26.59 0 top
R75  22R  [R0603]  95,30.16 90 top
R76  10k  [R0603]  90.43,30.16 270 top
R77  1k  [R0603]  74.94,54.42 180 top
R78  2.2K  [R0603]  74.81,56.52 180 top
R79  0.05R  [R2512]  109.86,92.33 0 top
R80  NP  [R0603]  119.39,69.15 0 top
R81  10K  [R0603]  119.26,67.56 0 top
R82  22R  [R0603]  111.45,28.19 0 top
R83  10k  [R0603]  114.63,28.19 0 top
R84  5.6K  [R0603]  119.07,27.56 270 top
R85  5.6K  [R0603]  122.25,11.05 180 top
R86  10k  [R0603]  123.83,18.67 0 top
R87  10k  [R0603]  117.48,34.86 270 top
R88  22R  [R0603]  120.66,18.67 180 top
R89  10k  [R0603]  108.91,39.94 0 top
R90  10k  [R0603]  72.08,18.35 180 top
R91  10k  [R0603]  51.44,19.62 180 top
R92  5k6  [R0603]  29.22,33.91 270 top
R93  1k  [R0603]  27.63,33.91 270 top
R94  1k  [R0603]  32.71,33.91 270 top
R95  5k6  [R0603]  34.3,33.91 270 top
R96  1k  [R0603]  37.79,33.91 270 top
R97  5k6  [R0603]  39.38,33.91 270 top
R98  1k  [R0603]  30.81,29.46 90 top
R99  5k6  [R0603]  29.22,29.46 270 top
R100  1k  [R0603]  35.89,29.46 90 top
R101  5k6  [R0603]  34.3,29.46 270 top
R102  1k  [R0603]  40.97,29.46 90 top
R103  5k6  [R0603]  39.38,29.46 270 top
R104  0R  [0603(1608)]  28.2,46.23 90 top
R105  22R  [R0603]  30.87,58.93 90 top
R106  22R  [R0603]  29.09,58.93 90 top
R107  22R  [R0603]  37.35,56.01 0 top
R108  22R  [R0603]  37.35,55.88 180 bottom
RJ1  HR911105A  [HR911105A]  10.29,38.73 180 top
RN1  4.7K  [0603-ARV]  13.47,66.17 0 top
S1  [TACTILE_SWITCH_SMD]  42.81,4.51 90 top
S2  [TACTILE_SWITCH_SMD]  40.2,20.7 90 top
S3  SWITCH-MOMENTARY-LEDPTH  [TACTILE-PTH-LED-12MM]  29.6,13.97 270 top
SJ1  [SJ_3]  15.62,8.87 180 bottom
SJ2  [SJ_3]  20.65,8.83 0 bottom
SJ3  [SJ_3]  70.49,40.89 180 bottom
SL1  [08P]  2.8,74.8 270 top
U1  USD-SOCKETNEW  [MICRO-SD-SOCKET-PP]  16.01,62.99 90 top
U$5  5MMCONN  [1715250000]  60.79,5.03 0 top
U$6  5MMCONN  [1715250000]  49.01,5.03 0 top
U$7  5MMCONN  [1715250000]  117.8,5.03 0 top
U$8  OSHW-LOGOH  [OSHW-LOGO-HUGE]  78.75,83.44 0 top
U$9  OSHW-LOGOH  [OSHW-LOGO-HUGE]  82.24,91.06 0 bottom
U$10  5MMCONN  [1715250000]  77.59,5.03 180 top
X6  [180G-2]  109.04,3.43 0 top
X7  [180G-2]  85.35,3.43 180 top
X8  [180G-2]  94.29,3.43 180 top
X9  [180G-2]  126.06,25.02 270 top
X10  [180G-2]  75.16,3.43 180 top
X11  [180G-2]  118.44,48.13 270 top
X12  [180G-2]  118.44,59.82 270 top
X13  [180G-2]  63.19,3.43 0 top
X14  USBPTH  [USB-B-PTH]  12.01,22.53 0 top
X15  [180G-2]  51.44,3.43 0 top
X16  [180G-2]  120.34,3.43 180 top

## Tracks (layer width: path | path; a pad name or v marks a point on that pad's centre or on a via)
3.3V  (via drill 0.3, 0.41, 0.58, 0.6)
  Top 0.254: 66.49,58.48 66.37,58.48 65.73,59.12 63.13,59.12 62.83,59.41 IC4.17 | 66.75,59.48 C31.2 66.87,59.63 | C12.2 45.98,56.57 45.98,55.63 47.44,54.17 47.44,53.31 IC1.84 | R29.2 45.03,67.31 | 62.81,39.12 C9.2 62.24,39.69 61.07,39.69 IC1.42 58.87,41.88 v58.87,43.12 | 57.79,55.94 57.79,55.95 C14.2 57.76,55.92 IC1.71 | R14.2 38.25,9.04 | v48.14,36.51 48.26,36.51 IC1.19 | R2.2 20.96,57.53 v20.96,55.22 20.96,54.06 C1.2 19.76,53.75 R1.2 R3.2 | JP31.1 34.51,67.72 | 34.51,67.72 36.14,67.72 JP30.2 | v35.36,70.27 35.25,70.27 34.51,69.53 34.51,67.72 | v62.68,69.53 62.17,69.02 R30.2 | v42.49,34.93 43.54,33.88 C13.2 | R4.2 89.07,67.19 IC9.17 89.07,63.76 v89.34,63.49 | IC1.54 62.38,48.51 64.97,48.51 C8.2 | IC1.28 55.67,35.18 v56.52,35.18 57.45,34.26 C10.2 | IC1.96 43.31,48.95 v43.31,49.02
  Top 0.305: 19.59,67.63 R25.2 v20.84,67.56 | 57.79,55.94 58.55,55.18 60.33,55.18 JP2.1 | R23.2 44.9,69.21 44.9,67.44 45.03,67.31 | R29.2 45.79,67.31 v46.83,66.27 | 66.43,58.48 66.37,58.48 66.68,58.8 66.75,58.8 66.68,58.74 66.68,58.23 66.43,58.48 | 66.43,58.48 66.62,58.48 66.75,58.36 66.75,57.02 66.87,56.9 66.87,55.44 | R38.2 v72.27,70.93 | R42.2 70.33,65.49 70.3,65.47 70.3,64.26 70.37,64.2 71,64.2 v71.57,64.77 | L1.2 41.82,37.31 41.35,36.83 41.35,36.07 v42.49,34.93 | C68.2 R4.2 | IC9.4 89.07,57.5 v89.02,57.46 | Q1.4 20.14,17.84 21.28,18.99 v21.28,19.62 | v85.85,62.54 85.85,61.28 R18.2 | C8.2 65.99,47.5 v66.68,47.5 | R24.2 v20.84,72.52 | R41.2 v72.27,72.58 | L7.2 v72.27,74.17 | R20.2 119.39,71.54 119.39,70 R80.2
  Top 0.406: R42.2 R35.2 R36.2 70.33,62.19 69.41,61.28 69.41,60.07 68.97,59.63 67.44,59.63 67.38,59.56 66.94,59.56 66.87,59.63 | 66.75,59.48 66.75,58.8 66.75,58.48 | 66.75,58.48 66.75,58.36 66.75,57.3 R37.2 66.9,55.35 68.08,54.17 70.24,54.17 71.32,55.25 73.26,55.25 R77.2 | 66.49,58.48 66.75,58.48 | 67.63,59.63 66.9,59.63 C31.2 | 35.25,20.89 35.25,17.21 38.26,14.2 R15.2 38.36,9.14 38.25,9.04 38.23,9.02 38.23,8.95 | v36.84,20.89 35.25,20.89 | 35.25,20.89 33.47,22.67 R17.1 R16.2 | C12.2 45.54,56.13 v44.84,56.13 | L5.2 v20.96,74.04 | v96.01,66.03 95.92,66.12 R45.2 R39.2 | L6.2 44.97,72.98 R28.2 v46.62,72.83 | L8.2 95.77,72.73 R44.2 97.16,72.58 v97.29,72.71 | v121.74,67.56 R81.2 120.24,67.69 R80.2 | L17.2 120.09,72.54 R20.2 | R22.1 20.84,70.87 v20.96,70.74
  Top 0.61: U1.4 7.13,57.35 7.43,57.65 19.51,57.65 | 19.51,57.65 R2.2 | C67.2 19.41,57.55 19.51,57.65 | 96.04,66.07 v96.01,66.03 | v69.41,39.31 69.41,39.49 70.05,40.13 70.49,40.58 71.95,40.58 C7.A
  Top 1.016: IC10.4 84.4,41.78 84.53,41.66 84.46,41.66 84.21,41.91 84.65,41.91
  GND 0.406: v96.01,66.03 96.06,65.98 107.96,65.98 110.5,68.52 120.78,68.52 v121.74,67.56
  Power 0.305: v46.83,66.27 46.81,66.29 | v71.57,64.77 71.64,64.77 | v62.68,69.53 62.55,69.66
  Power 0.61: 96.53,64.39 96.53,65.51 v96.01,66.03
  Bottom 0.254: C11.2 43.31,49.15 v43.31,49.02
  Bottom 0.305: v58.87,43.12 v58.88,43.12 61.6,43.12 63.83,45.34 64.78,45.34 69.22,40.89 69.22,39.5 v69.41,39.31 | FB2.1 33.83,59.09 v34.42,59.69
  Bottom 0.406: SJ2.1 21.53,10.1 22.17,10.73 v22.55,10.73 | SJ3.1 69.22,40.89 | 39.25,50.42 FB3.2 40.01,50.42 v40.9,49.53 40.14,48.77 FB4.2 | 25.66,46.82 FB1.1 25.7,46.57 v26.8,45.47
  Bottom 0.61: SJ1.1 14.73,10.29 v14.29,10.73
  other vias: 83.71,48.39 82.94,47.94 83.19,45.09 84.15,44.39
  pour Power (rank 6): 106.28,75.03 106.28,-0.97 -0.99,-0.97 -0.99,75.53
  pour Top (isolate 0.254, rank 2, no thermals): 77.16,43.12 79.7,43.12 81.92,45.34 81.92,48.2 82.56,48.83 96.53,48.83 96.53,31.37 81.29,31.37 81.41,38.93 79.81,40.53 77.16,40.58 76.84,40.89 76.84,42.8
5V  (via drill 0.41, 0.6)
  Top 0.406: 75.26,39.56 C64.A 73.8,38.67 v72.46,38.67
  Top 0.813: D6.C v86.05,38.67
  GND 0.61: v53.76,19.03 60.51,25.78 76.76,25.78 80.26,29.28 80.26,33.74 v80.05,33.94
  Power 0.61: 80.05,38 v80.05,37.94
  Power 0.813: v98.75,60.9 v98.75,62.8 v98.75,61.85 94.3,61.85 93.67,61.21 93.67,38.58 93.04,37.94 85.41,37.94 | 85.41,37.94 v80.05,37.94 | 80.05,38 80.02,38.04 | v86.05,38.67 86.05,38.58 85.41,37.94
  Bottom 0.254: 16.76,13.53 16.64,13.42 16.64,11.49
  Bottom 0.406: 16.64,9.01 19.76,9.01 SJ2.3 | SJ3.3 72.46,39.81 v72.46,38.67
  Bottom 0.61: v53.76,19.03 52.26,19.03 50.76,20.53 40.01,20.53 37.51,18.03 24.51,18.03 21.26,14.78 18.01,14.78 16.76,13.53 | 16.64,11.49 16.64,9.01 SJ1.3
  pour Top (isolate 0.254, rank 3, no thermals): 81.01,33.03 81.01,39.28 79.76,40.53 74.01,40.53 74.01,36.28 77.01,33.03
  pour Top: 98.43,64.39 102.24,64.39 102.88,63.75 102.88,60.26 102.24,59.63 98.43,59.63 97.8,60.26 97.8,63.75
5VREG
  Top 0.406: C76.1 95.57,42.16 93.04,44.7 IC13.3
  Top 0.813: D6.A 92.84,42.04 91.45,43.43 IC13.3
  pour Top: 89.86,45.66 92.72,45.66 96.21,42.16 96.21,38.99 92.08,38.99 88.91,42.16 88.91,44.7
12VREG  (via drill 0.6)
  Top 0.254: IC14.6 70.35,23.88 70.03,23.55 C66.1
  Top 0.406: IC11.1 67.06,19.84 | C62.1 67.06,19.84 | C66.1 70.03,20.47 69.68,20.12 | 69.68,20.12 69.4,19.84 67.06,19.84 | C75.1 111.55,35.5 110.92,34.86 IC15.6 | v71.13,19.62 70.18,19.62 69.68,20.12
  Top 0.61: C75.1 109.86,37.4 v109.54,37.72
  Power 0.61: v71.13,19.62 100.02,19.62 109.54,29.15 v109.54,37.72
22222  (via drill 0.41, 0.6)
  Top 0.254: IC1.82 50.29,51.88 52.14,51.88 52.59,51.44 52.59,45.59 53.22,44.96 54.11,44.96 56.4,42.67 v56.65,42.67 | JP24.2 31.76,16 34.82,16 36.35,14.48 S3.A
  Top 0.305: v36.35,8.74 S3.A
  GND 0.254: v39.76,18.29 41.28,19.81 47.6,19.81 47.82,20.03 53,20.03 59.52,26.54 75.13,26.54 75.29,26.7 75.35,26.7 77.1,28.45 77.1,36.58 76.14,37.53 v72.52,37.53
  Bottom 0.254: v72.52,37.53 69.29,37.53 65.79,41.02 65.03,41.02 64.27,41.78 57.54,41.78 v56.65,42.67
  Bottom 0.305: v39.76,18.29 36.35,14.88 S3.A
+5V
  pour Top: 120.66,63.12 115.9,63.12 114.63,64.39 104.47,64.39 103.83,63.75 103.83,60.26 104.47,59.63 114.94,59.63 115.58,60.26 120.66,60.26 120.98,60.58 120.98,62.8
AGND  (via drill 0.41)
  Top 0.254: C6.2 45.61,36.34 v46.71,37.43 46.71,37.79 IC1.15 48.59,39.67 48.59,40.32 47.82,41.09 47.17,41.09 IC1.11
  Top 0.406: C21.C SL1.1 | C22.C 5.78,78.11 5.28,78.61 SL1.3 | C23.C 5.72,72.52 4.71,73.53 SL1.5 | C24.C 9.54,67.24 9.09,67.69 3.56,67.69 SL1.7
  Power 0.254: v46.71,37.43 46.71,43.08 47.51,43.88 47.51,45.97 45.73,47.75 45.73,48.77 47.51,50.55 47.51,55.63 | 35.71,66.03 7.51,66.03 5.08,68.45 SL1.7 | 47.51,55.62 47.51,55.63 | 35.71,66.03 42.55,59.18 43.95,59.18 47.31,55.82 47.51,55.63 | 35.71,66.03 35.69,66.04
  pour GND (isolate 0.254): -0.89,85.53 -0.89,63.83 8.41,63.83 8.41,85.53
AVCC  (via drill 0.41)
  Top 0.254: 43.89,39.44 L1.1 | 43.89,39.44 44.82,39.44 | 44.82,39.44 IC1.10 | IC1.12 46.24,39.44 44.82,39.44 | v11.91,64.13 11.91,65.18 RN1.1 RN1.2 RN1.3 RN1.4 | C6.1 43.11,38.57 L1.1 | 43.01,38.55 L1.1 | 43.89,39.44 v43.89,39.41 v43.9,39.4
  Power 0.254: v11.91,64.13 13.31,65.53 35.32,65.53 42.43,58.42 43.82,58.42 46.91,55.34 46.91,51.47 45.6,50.17 45.6,49.91 43.9,48.21 v43.9,39.4
DIR1  (via drill 0.41, 0.6)
  Top 0.254: JP7.2 v28.77,69.41 28.77,66.87 30.74,64.9 44.46,64.9 51.57,57.79 51.57,55.63 52.46,54.74 52.46,54.23 51.06,52.83 50.75,52.83 IC1.80
  Top 0.305: v24.39,85.03 24.14,85.28 24.14,85.34 23.95,85.53 18.23,85.53 18.05,85.35 IC2.P14
  Power 0.254: v24.39,85.03 25.51,83.91 25.51,75.28 JP7.2
DIR2  (via drill 0.41, 0.6)
  Top 0.254: JP9.2 49.99,74.55 51.01,73.53 51.01,68.53 50.01,67.53 50.01,65.76 v52.14,63.63 | v57.79,46.23 59.62,44.4 61.3,44.4 IC1.49
  Top 0.305: IC3.P14 43.7,85.22 44.08,85.6 45.79,85.6 v46.3,85.09
  Power 0.305: v46.3,85.09 49.92,85.09 51.95,83.06 51.95,75.95 50.55,74.55 JP9.2
  Bottom 0.254: v57.79,46.23 57.35,46.23 56.33,47.24 55.82,47.24 52.71,50.36 52.71,52.83 54.62,54.74 54.62,61.15 52.33,63.44
  Bottom 0.305: 52.33,63.44 v52.14,63.63
DIR3  (via drill 0.41, 0.6)
  Top 0.254: IC1.58 59.07,48.03 58.26,48.03 57.76,48.53 56.76,48.53 56.42,48.2 v56.2,48.2 | 70.75,60.13 70.75,57.79 v70.11,57.15
  Top 0.305: IC5.P14 69.29,85.28 69.54,85.53 71.38,85.53 v71.95,84.96 | 70.75,60.13 76.84,66.23 76.84,72.33 75.64,73.53 JP12.2
  Power 0.305: v71.95,84.96 75.64,84.96 77.29,83.31 77.29,75.31 JP12.2
  Bottom 0.254: 57.67,49.47 56.4,48.2 v56.2,48.2
  Bottom 0.305: 75.64,73.53 JP12.2 | 57.67,49.47 65.79,49.47 68.33,52.01 68.33,55.94 69.54,57.15 v70.11,57.15
DIR4  (via drill 0.41, 0.6)
  Top 0.254: IC1.56 59.03,46.58 v58.99,46.58 | 72.08,57.72 72.08,56.45 v71.83,56.2
  Top 0.305: 72.08,57.72 72.08,59.56 78.81,66.29 78.81,70.36 JP15.2 | 95.96,85.6 95.89,85.66 94.81,85.66 94.5,85.35 IC6.P14 94.5,85.28 94.81,85.6 95.96,85.6 | 95.96,85.6 96.21,85.34 v96.21,83.31
  Power 0.305: JP15.2 80.72,71.69 81.29,72.26 81.29,75.25 80.84,75.69 79.7,75.69 78.68,76.71 78.68,83.38 79.57,84.27 85.41,84.27 85.61,84.07 87.19,84.07 88.34,85.22 94.3,85.22 v96.21,83.31
  Bottom 0.254: v71.83,56.2 69.48,53.85 69.48,51.44 66.3,48.26 60.67,48.26 v58.99,46.58
DIR5  (via drill 0.41, 0.6)
  Top 0.254: IC1.50 64.05,45.59 v65.98,45.59
  Top 0.305: IC12.P14 118.32,84.91 118.75,85.34 121.29,85.34 v121.93,84.71
  GND 0.305: v90.81,71.37 83.19,71.37 82.05,72.52 82.05,75.06 81.54,75.56 79.13,75.56 | v54.11,65.15 54.11,71.5 55.13,72.52 57.03,72.52 58.17,73.66 58.17,75.44 58.68,75.95 61.98,75.95 62.62,76.58 72.91,76.58 73.67,77.34 77.35,77.34 79.13,75.56 | 79.13,75.56 79.19,75.5
  GND 0.457: v121.93,84.71 121.93,73.6 120.98,72.64 114.94,72.64 114.63,72.96 113.35,72.96 113.04,72.64 JP18.2
  Power 0.254: v54.11,65.15 55.89,65.15 56.52,64.51 56.52,58.48 56.97,58.04 56.97,53.09 59.38,50.67 62.43,50.67 65.98,47.12 v65.98,45.59
  Power 0.305: JP18.2 105.1,70.74 91.45,70.74 v90.81,71.37
EN1  (via drill 0.6)
  Top 0.254: JP7.1 29.92,70.8 29.92,66.48 31,65.41 44.71,65.41 52.08,58.04 52.08,55.88 52.97,54.99 52.97,54.1 51.19,52.32 50.55,52.32 IC1.81
  Top 0.305: IC2.P23 12.2,85.22 11.95,85.47 10.74,85.47 v10.29,85.03
  Power 0.305: v10.29,85.03 10.29,85.34 10.42,85.47 22.36,85.47 24.58,83.25 24.58,77.28
  Power 0.406: 24.58,77.28 24.58,76.52 JP7.1
EN2  (via drill 0.41, 0.6)
  Top 0.254: JP9.1 50.45,77.09 51.76,75.78 51.76,66.8 v51.19,66.23 | IC1.48 61.09,43.9 59.38,43.9 58.71,44.58 57.86,44.58 v57.09,45.34
  Top 0.305: IC3.P23 37.85,85.16 37.54,85.47 36.77,85.47 v36.01,84.71
  Power 0.254: 51.19,77.85 50.43,77.09 JP9.1
  Power 0.305: v36.01,84.71 36.01,85.09 36.33,85.41 44.58,85.41 45.92,84.07 49.85,84.07 51.19,82.74 51.19,77.85
  Bottom 0.254: v51.19,66.23 51.19,62.99 54.05,60.13 54.05,55.05 52.14,53.15 52.14,50.04 55.44,46.74 55.7,46.74 v57.09,45.34
EN3  (via drill 0.41, 0.6)
  Top 0.254: IC1.59 58.86,48.53 58.51,48.53 57.44,49.59 v56.4,49.59 | v73.48,64.39 73.48,64.25 70.19,60.96 70.19,59.45 v68.65,57.91 | IC5.P23 63.44,85.1 63.01,85.53 61.66,85.53 v61.6,85.47
  Power 0.254: v61.6,85.47 62.04,85.47
  Power 0.305: 62.04,85.47 69.98,85.47 71.51,83.95 73.03,83.95 73.35,84.27 75.32,84.27 76.46,83.12 76.46,77.02 JP12.1
  Bottom 0.254: v68.65,57.91 67.76,57.02 67.76,52.2 65.6,50.04 56.84,50.04 v56.4,49.59
  Bottom 0.305: JP12.1 75.51,76.03 73.76,74.28 73.76,64.67 v73.48,64.39
EN4  (via drill 0.41, 0.6)
  Top 0.254: IC1.57 59.28,47.53 57.44,47.53 v57.35,47.62 | v69.67,55.44 71.32,57.09 71.32,59.82
  Top 0.305: IC6.P23 88.65,85.22 88.34,85.53 87,85.53 v86.49,85.03 | 71.32,59.82 77.73,66.23 77.73,73.28 78.68,74.23 JP15.1
  Power 0.305: v86.49,85.03 79.38,85.03 77.99,83.63 77.99,76.39 JP15.1
  Bottom 0.254: v57.35,47.62 57.35,47.94 58.24,48.83 66.11,48.83 68.9,51.62 68.9,54.67 v69.67,55.44
EN5  (via drill 0.41, 0.6)
  Top 0.254: IC1.85 48.29,51.73 49.98,50.04 v51.38,50.04
  Top 0.305: IC12.P23 112.47,84.96 112.09,85.34 109.86,85.34 v109.23,84.71
  GND 0.254: 61.92,74.87 75.89,74.87
  GND 0.305: 75.89,74.87 77.79,72.96 80.65,72.96 82.88,70.74 89.86,70.74 90.18,70.42 91.45,70.42 91.76,70.74 101.29,70.74 105.74,75.18 JP18.1 | v54.68,62.99 55.25,63.56 55.25,68.2 61.92,74.87
  GND 0.457: v109.23,84.71 107.01,82.49 JP18.1
  Power 0.254: v54.68,62.99 52.46,60.77 52.46,50.42 52.08,50.04 v51.38,50.04
ENET_CRS
  Top 0.254: IC1.92 43.03,52.07 42.43,52.07 40.27,54.23 R60.2
ENET_MDC  (via drill 0.3)
  Top 0.254: v44.2,52.71 42.68,52.71 39.38,56.01 R107.2 | IC1.87 46.11,52.52 v46.11,52.83
  Bottom 0.254: v44.2,52.71 45.98,52.71 v46.11,52.83
ENET_MDIO  (via drill 0.3)
  Top 0.254: v46.11,54.1 46.36,54.1 46.87,53.59 46.87,52.47 IC1.86
  Bottom 0.254: R108.2 39.5,55.88 42.04,53.34 45.35,53.34 v46.11,54.1
ENET_REF_CLK
  Top 0.254: IC1.88 38.83,59.09 R51.2
ENET_RX_ER  (via drill 0.3)
  Top 0.254: IC1.89 45.4,51.82 v44.84,51.82 | IC8.10 v35.06,53.97 v35.06,53.98
  Power 0.254: v35.06,53.98 41.41,53.98 43.57,51.82 v44.84,51.82
  Bottom 0.254: R53.1 35.82,52.32 35.06,53.09 v35.06,53.98
ENET_RXD0  (via drill 0.3)
  Top 0.254: R58.2 40.77,48.64 v41.41,48.01 | IC1.91 47,48.81 47,48.26 v46.87,48.13
  Bottom 0.254: v41.41,48.01 46.74,48.01 v46.87,48.13
ENET_RXD1  (via drill 0.3)
  Top 0.254: R59.2 v41.54,46.86 | 47.89,48.64 v47.87,48.64 IC1.90
  Bottom 0.254: v41.54,46.86 46.62,46.86 47.87,48.12 v47.87,48.64
ENET_TX_EN  (via drill 0.3)
  Top 0.254: IC1.93 43.97,50.42 v43.57,50.42 | IC8.16 31.76,57.28 v32.14,57.66
  Power 0.254: v32.14,57.66 32.14,58.17 32.52,58.55 33.54,58.55 34.17,57.91 34.17,53.72 34.68,53.21 40.77,53.21 v43.57,50.42
ENET_TXD0  (via drill 0.3)
  Top 0.254: IC1.95 46.49,46.48 48.65,46.48 v49.28,47.12 | R105.2 30.87,61.09 v33.41,63.63
  Bottom 0.254: v49.28,47.12 49.28,48.9 48.27,49.91 48.27,54.61 39.25,63.63 v33.41,63.63
ENET_TXD1  (via drill 0.3)
  Top 0.254: IC1.94 46.69,46.99 47.63,46.99 v48.52,47.88 | R106.2 29.09,60.33 v31.5,62.74
  Bottom 0.254: 47.76,49.66 47.76,49.78 | v31.5,62.74 31.63,62.87 39.25,62.87 47.76,54.36 47.76,50.29 47.76,49.78 | v48.52,47.88 48.65,48.01 48.65,48.9 47.76,49.78
ETA_CURRENT  (via drill 0.6)
  Top 0.305: IC9.2 87.77,58.17 v87.64,58.04
  Power 0.305: v87.64,58.04 87,58.04 86.37,58.67 84.78,58.67 83.83,57.72 82.56,57.72 JP34.3
GND  (via drill 0.3, 0.41, 0.6, 0.6 pad 1.02)
  Top 0.254: C14.1 58.68,57.47 57.73,57.47 56.59,56.32 56.59,55.45 IC1.72 | 60.23,58.45 IC4.13 60.23,61.18 v60.59,61.53 61.94,61.53 62.18,61.29 | IC1.41 59.25,40.77 | 59.25,40.77 60.97,39.05 61.48,39.05 62.55,37.97 63.95,37.97 C9.1 | 58.62,33.02 58.62,34.35 56.84,36.13 56.84,36.14 IC1.31 | IC1.55 | 44.05,47.52 IC1.97 45.6,45.96 v45.6,45.59 | IC4.3 IC4.4 62.81,65.95 62.81,64.77 62.62,64.58 61.03,64.58 60.88,64.73 IC4.7 IC4.8 | IC4.16 62.18,61.29 | 62.18,61.29 62.49,61.6 63.19,61.6 63.51,61.28 63.51,60.16 IC4.18 | 59.25,40.77 57.73,42.29 v57.73,42.67 | C8.1 66.23,49.66 65.67,49.66 65.03,49.02 62.18,49.02 IC1.55 | 60.27,57.28 61.67,57.28 JP3.3 | C12.1 47.38,55.56 | C12.1 | C12.1 47.31,55.5 47.91,54.9 47.91,53.55 IC1.83 49.98,51.48 50.28,51.18 v51.38,51.18 | 45.41,32.13 45.39,32.13 C2.2 | C3.2 46.81,30.23 | IC14.3 66.39,23.86 69.22,23.86 | C31.1 67.79,61.3 v68.97,62.48 | 45.35,32.07 43.75,32.07 C13.1 | IC1.55 60.14,46.98 v60.14,45.85 | IC11.2@1 64.16,17.09 | 69.22,23.86 v69.22,24.7 | C66.2 68.33,21.27 69.22,22.16 69.22,23.86 | R74.2 78.41,26.59 78.43,26.61 v79.7,26.61 | R90.2 68.96,18.35 | C78.2 30.8,35.81 v30.49,36.13 | C79.2 35.88,35.18 v34.93,36.13 | v32.39,27.24 31.76,27.88 31.76,30.1 31.97,30.31 C82.2 | v36.84,27.24 36.84,29.78 37.37,30.31 C83.2 | v44.35,35.11 44.39,35.11 45.41,36.13
  Top 0.305: C15.1 v9.47,71.5 | 31.69,92.33 R34.1 31.75,91.75 31.69,91.69 | 59,57.21 C14.1 59.1,57.31 60.23,57.31 | 60.23,58.45 60.23,57.31 | 60.23,57.31 60.27,57.28 | IC4.8 60.78,65.97 60.84,65.91 | 60.84,65.91 60.84,66.04 | 60.84,65.91 60.84,64.58 v60.52,64.26 | 58.62,32.96 58.24,32.58 58.24,27.3 57.48,26.54 | C2.2 46.45,32.17 46.81,31.81 46.81,30.23 | v45.35,30.61 45.35,32.07 45.41,32.13 | S2.4 S2.3 | S1.4 S1.3 | Q9.3 90.43,27.23 R76.2 | Q8.3 80.95,27.34
  Top 0.406: IC2.P24 | LED10.C LED9.C LED4.C LED3.C LED2.C LED1.C | 1.47,49.4 U1.GND1 | 15.12,81.22 15.18,81.15 | C33.1 83.83,72.26 | C32.1 58.66,70.93 58.51,70.78 | Q7.S 44.71,15.11 S1.4 | IC11.2@1 IC11.2 | 64.16,17.09 C62.2 | v48.9,66.29 48.9,67.56 | R86.2 v126.37,18.67 | C76.2 95.36,38.04 95.26,38.04 95.57,37.72 v95.57,36.45 | v49.09,19.05 49.09,19.62 | 49.09,19.62 49.09,20.57 49.73,21.21 R72.1 | R91.2 49.09,19.62 | 21.32,52.01 C1.1 | IC7.3 36.14,57.72 36.2,57.66 v37.09,57.66 | C59.2 29.98,45.19 v29.98,43.94
  Top 0.61: 79.57,44.09 IC10.1 75.89,44.09 75.26,43.46 C64.C C7.C | S2.3 42.11,17.18 43.86,15.43 Q7.S | 78.11,44.07 78.11,45.34 79.07,45.34 | v111.45,20.26 111.45,21.21 | 111.45,21.21 111.45,21.84 109.23,21.84 v109.23,21.21 111.45,21.21
  Top 1.676: 106.69,57.09 111.45,57.09 | 111.45,57.09 111.45,52.01 106.69,52.01 | 111.45,57.09 115.26,57.09 116.21,58.04 120.66,58.04
  Top 2.54: IC2.EPAD 15.18,81.15
  GND 0.406: 75.13,17.34 75.19,17.4
  Power 0.406: Q5.S 117.8,17.08 119.39,18.67 v126.37,18.67
  other vias: 96.15,79.06 94.88,80.52 93.16,81.98 93.16,80.39 91.57,81.98 89.99,81.98 91.57,80.39 46.68,74.93 46.3,70.99 21.15,50.48 89.23,27.88 97.8,67.25 59.25,30.67 72.33,75.56 30.61,102.68 30.61,100.58 25.79,102.81 25.73,100.33 55.51,103.12 55.51,100.9 51.76,103.06 51.76,100.96 83.51,72.64 103.07,96.52 103,94.04 103,91.76 101.29,96.52 89.99,80.39 88.46,81.85 88.46,80.52 87,82.68 87,81.22 87,79.82 85.54,82.68 85.54,81.15 85.61,79.76 83.95,82.68 83.95,80.9 83.95,79.31 83.95,77.72 96.97,81.53 97.8,80.64 97.8,79.44 67.95,81.98 67.95,80.33 66.37,81.98 66.37,80.33 64.84,81.98 64.84,80.33 63.13,80.52 69.6,80.39 69.6,81.79 71.7,82.55 71.76,80.96 71.76,79.57 73.29,82.55 73.29,81.03 73.29,79.57 74.81,82.55 74.81,81.09 74.81,79.63 74.81,78.17 63.13,81.79 59.7,77.22 61.16,83.44 61.16,82.04 61.16,80.58 61.16,79.12 61.16,77.6 59.63,84.39 59.63,82.99 59.63,81.6 59.7,80.14 59.7,78.68 56.4,84.2 56.4,82.11 56.4,80.07 54.55,84.2 54.55,82.11 54.55,80.07 56.33,78.3 54.55,78.36 52.97,84.14 52.97,82.11 52.97,80.07 53.09,78.55 40.77,81.98 40.77,80.26 39.25,81.98 39.25,80.26 42.3,82.04 42.3,80.33 43.95,81.98 43.95,80.33 37.41,82.04 37.47,80.39 35.95,83.12 35.95,81.41 35.95,79.63 35.89,77.91 34.42,84.45 34.42,82.8 34.42,81.15 34.49,79.5 34.49,77.79 32.9,84.01 32.9,82.3 32.9,80.71 32.96,78.99 29.85,84.33 29.85,82.49 29.85,80.71 29.85,78.93 29.85,75.25 28.27,84.26 28.33,82.49 28.33,80.71 28.33,78.93 26.8,84.33 26.87,82.49 26.8,80.77 26.74,78.93 15.12,81.98 15.12,80.33 13.66,81.98 13.66,80.33 11.88,82.11 11.95,80.33 10.49,82.99 10.49,81.6 10.49,80.14 9.91,78.8 9.15,82.99 9.15,81.6 16.64,81.98 16.64,80.33 18.36,82.04 18.36,80.26 20.26,83.95 20.26,82.49 20.26,81.03 20.26,79.57 21.66,83.95 21.66,82.55 21.72,81.09 21.72,79.57 23.06,82.55 23.06,81.15 23.06,79.82 45.85,82.49 45.85,80.96 45.85,79.44 47.44,82.49 47.44,81.03 47.44,79.57 49.03,82.49 49.03,81.03 49.03,79.69 4.58,97.03 3.06,97.03 4.64,87.31 4.64,85.66 2.93,89.03 2.99,87.31 2.99,85.72 2.17,94.17 2.17,91.25 82.37,82.68 82.37,80.9 82.37,79.31 82.37,77.66 80.78,82.68 80.78,80.96 80.78,79.31 80.78,77.66 80.51,102.53 80.51,100.53 76.51,100.53 76.51,102.53 89.23,25.34 16.39,71.31 3.11,59.54 3.11,58.29 3.11,60.79 17.47,56.45 16.2,52.64 18.11,60.58 15.25,31.75 20.65,32.64 14.61,36.45 22.23,39.18 40.17,38.23 18.04,27.5 113.51,80.9 117.32,80.9 116.69,81.85 115.42,81.85 114.15,81.85 114.15,79.95 115.42,79.95 116.69,79.95 112.88,79.95 112.88,81.85 117.96,81.85 117.96,79.95 118.59,80.9 119.23,81.85 119.23,79.95 119.86,80.9 112.24,80.9 111.61,81.85 111.61,79.95 110.97,80.9 110.34,81.85 110.34,79.95 120.5,81.85 120.5,79.95 105.26,92.33 105.26,93.6 105.26,91.06 106.53,94.87 107.8,94.87 106.53,89.79 107.8,89.79 125.58,92.33 125.58,93.6 124.63,94.87 123.36,94.87 125.64,88.27 125.64,89.53 125.58,91.06 112.09,13.91 108.59,12 112.09,12 89.23,26.61 108.59,13.91 80.97,25.34 79.7,25.34 90.5,25.34 66.05,15.81 2.23,27.3 2.23,25.46 2.23,19.56 2.23,17.34 21.6,26.29 21.28,21.21 17.47,16.45 4.14,49.47 2.55,52.01 7.95,53.91 9.53,60.58 81.92,54.23 81.92,52.32 81.92,50.42 83.19,56.77 78.43,61.85 92.08,51.37 95.26,51.37 95.26,54.86 91.45,55.5 88.27,52.96 95.26,57.4 95.26,60.26 95.26,63.44 104.63,78.23 100.82,79.82 4.71,26.35 15.88,19.62 16.2,21.53 15.88,25.65 4.96,29.34 14.3,15.81 6.96,18.35 14.61,52.83 13.66,51.37 10.1,51.37 6.36,51.05 12.39,52.96 2.87,55.18 13.03,61.53 109.23,22.48 110.18,20.26 109.23,23.75 39.7,36.13 88.91,61.21 87.96,63.12 91.13,63.12 92.08,61.21 27.57,31.5 34.68,39.5 37.09,39.37 40.9,58.17 42.68,56.39 40.39,56.13 42.55,54.23 44.71,54.48 32.9,43.18 32.01,53.72 24.39,44.32 39.38,52.45 26.3,57.53 36.2,44.2 23.76,52.58 24.39,53.21 21.22,38.29 50.55,33.66 16.51,69.91 20.96,75.63 71.76,66.67 67.57,71.25 67.83,69.72 97.29,75.69 121.67,71.25 39.63,57.02 38.74,57.53 42.04,57.4 40.01,59.31 37.6,61.98 41.41,55.12 43.7,55.5 39.25,60.2 27.44,59.69 27.44,58.29 24.52,57.02 24.52,55.75 23.12,55.37 39.63,44.96 38.36,44.83 31.5,43.18 29.85,42.8 29.09,41.66 31,41.78 28.07,40.89 40.39,52.32 51.19,32.64 50.05,32.26 50.17,30.48 45.09,26.54 46.49,26.8 33.54,24.51 34.68,24.51 25.41,28.07 26.3,28.96 21.22,42.55 21.6,43.69 21.85,44.83 21.98,46.1 19.31,46.74 19.31,45.47
  pour GND (rank 6): 129.55,111.38 129.55,-1.65 0.01,-1.65 0.01,111.38
  pour Top: 57.48,32.45 57.48,31.69 55.76,29.97 55.76,24.45 56.4,23.81 59,23.81 60.33,25.15 60.33,25.46 59.82,25.97 59.82,32.96 59.06,33.72 58.68,33.72 57.41,32.45
  pour Top: 24.84,99.57 24.84,103.31 25.53,104.01 31.31,104.01 31.95,103.38 31.95,99.63 31.31,99 25.41,99
  pour Top: 50.81,100.65 50.81,103.7 51.44,104.33 56.21,104.33 56.84,103.7 56.84,99.82 56.59,99.57 51.89,99.57
  pour Top (rank 6): 100.02,85.66 100.02,98.36 108.28,98.36 108.28,85.66
  pour Bottom (rank 6): -2.53,110.89 132.09,110.89 132.09,-1.65 -2.53,-1.65
  pour Top (isolate 0.254): -1.09,63.83 -1.09,48.23 21.71,48.23 21.71,63.83
  pour Top (isolate 0.254, no thermals): 91.45,28.51 91.13,28.83 88.59,28.83 88.27,28.51 88.27,24.7 88.59,24.38 91.13,24.38 91.45,24.7
  pour Top (isolate 0.254, rank 6): 132.09,-4.19 132.41,109.47 83.01,109.03 83.01,99.03 74.01,99.03 74.01,109.03 58.01,109.03 58.01,99.03 50.01,99.03 50.01,109.03 33.01,109.03 33.01,98.03 25.01,98.03 25.01,109.03 -3.99,109.03 -3.99,67.03 82.01,67.03 82.01,57.4 78.43,57.4 78.43,42.8 81.92,42.8 81.92,-4.19
  pour GND (isolate 0.254, rank 6, no thermals): 109.01,-4.97 109.01,26.03 60.01,26.03 53.01,19.03 44.01,19.03 43.01,18.03 43.01,-4.97
  pour Power (isolate 0.254, rank 2, no thermals): 71.76,16.13 71.76,11.37 67.64,7.24 67.64,3.43 66.68,2.48 64.46,2.48 63.83,3.11 63.83,10.73 69.54,16.76 71.13,16.76
  pour Top (isolate 0.254): -0.74,30.03 -0.74,14.28 24.01,14.28 24.01,25.78 20.26,30.03 15.26,30.03 14.01,28.78 12.51,28.78 11.26,30.03
  pour Top (rank 6): 83.01,109.03 74.01,109.03 74.01,100.03 75.01,99.03 82.01,99.03 83.01,100.03
  pour Top (rank 6): 58.01,109.03 50.01,109.03 50.01,99.03 58.01,99.03
  pour Top (rank 6): 33.01,109.03 25.01,109.03 25.01,98.03 33.01,98.03
  pour Top (rank 6): 104.52,73.03 98.37,73.03 98.37,67.03 104.52,67.03
  pour Top (no thermals): 109.23,82.8 122.25,82.8 122.25,78.99 109.23,78.99
  pour Bottom (rank 6): 106.37,64.39 121.61,64.39 122.25,63.75 122.25,43.12 106.37,43.12 105.74,43.75 105.74,63.75
  pour Top (no thermals): 79.38,28.83 81.29,28.83 81.92,28.19 81.92,25.02 81.29,24.38 79.38,24.38 78.75,25.02 78.75,28.19
  pour Bottom (rank 3, no thermals): 109.55,1.21 109.55,10.41 116.53,17.4 118.75,17.4 119.07,17.08 119.07,7.87 112.4,1.21
  pour Power (rank 5, no thermals): 132.41,-1.97 132.41,38.99 110.82,38.99 110.82,29.78 106.69,25.65 94.31,25.65 91.13,28.83 84.15,28.83 74.62,19.3 79.38,19.3 79.7,18.99 79.7,-1.97
  pour Top (rank 6): 59.38,19.3 59.38,10.41 60.33,9.46 76.21,9.46 76.21,13.59 72.4,13.59 71.76,14.22 71.76,19.3
  pour Top (rank 6, no thermals): 61.6,19.3 65.73,19.3 65.73,14.22 61.6,14.22
  pour Top (rank 6): -3.04,-5.21 135.39,-5.21 135.39,111.38 -3.04,111.38
GPIO_FET
  Top 0.254: Q7.G 52.29,17.61 R70.2 R91.1
GPIO_FET1
  Top 0.406: R88.1 R86.1 122.98,15.6 Q5.G
ISP_BOOT  (via drill 0.41)
  Top 0.254: S2.1 38.3,15.96 R15.1 | 38.46,16 R15.1 | IC1.53 60.97,46.4 60.97,45.53 v61.22,45.28 | JP25.3 38.36,16 R15.1 | S2.2 v38.3,24.7 | v55.13,41.02 v51.7,41.02
  Top 0.406: S2.2 S2.1
  Bottom 0.254: 61.22,45.21 v61.22,45.28 60.9,44.96 59.32,44.96 58.94,45.34 58.17,45.34 56.78,43.94 55.63,43.94 55,43.31 55,41.78 55.13,41.66 v55.13,41.02 | v51.7,41.02 49.66,38.99 47,38.99 44.58,36.58 42.55,36.58 41.28,35.31 41.28,31.62 41.79,31.11 41.79,30.1 43.44,28.45 43.44,27.3 42.04,25.91 40.9,25.91 39.7,24.7 v38.3,24.7
J1_1A
  Bottom 1.422: D7.2 18.8,106.52 J1.1
  pour Top (no thermals): 17.91,109.22 19.69,109.22 19.69,101.09 17.79,101.09 17.79,109.22
J1_1B
  Bottom 1.422: D8.2 16.26,104.61 J1.2
  pour Top (no thermals): 15.37,109.22 17.15,109.22 17.15,105.54 17.28,105.41 17.41,105.28 17.41,101.09 15.76,101.09 15.37,101.09
J1_2A
  Bottom 1.422: D9.2 13.72,105.25 J1.3
  pour Top (no thermals): 12.83,109.22 14.61,109.22 14.61,101.09 12.07,101.09 12.07,104.77 12.83,105.54
J1_2B
  Bottom 1.422: D10.2 8.61,103.98 11.18,106.55 J1.4
  pour Top (no thermals): 10.93,109.22 12.2,109.22 12.2,105.54 11.56,104.9 11.56,101.09 9.53,101.09 9.53,105.54 10.29,106.3 10.29,109.22
J2_1A
  Bottom 1.422: D11.2 44.84,106.52 J2.1
  pour Top (no thermals): 43.95,109.22 45.73,109.22 45.73,101.09 43.82,101.09 43.82,109.22
J2_1B
  Bottom 1.422: D12.2 42.3,104.61 J2.2
  pour Top (no thermals): 41.41,109.22 43.19,109.22 43.19,105.54 43.31,105.41 43.44,105.28 43.44,101.09 41.79,101.09 41.41,101.09
J2_2A
  Bottom 1.422: D13.2 39.76,105.25 J2.3
  pour Top (no thermals): 38.87,109.22 40.65,109.22 40.65,101.09 38.11,101.09 38.11,104.77 38.87,105.54
J2_2B
  Bottom 1.422: D14.2 34.52,103.98 37.22,106.68 J2.4